# EAGLE design badi (EAGLE 7.6.0)

## Sheet 1 of 2
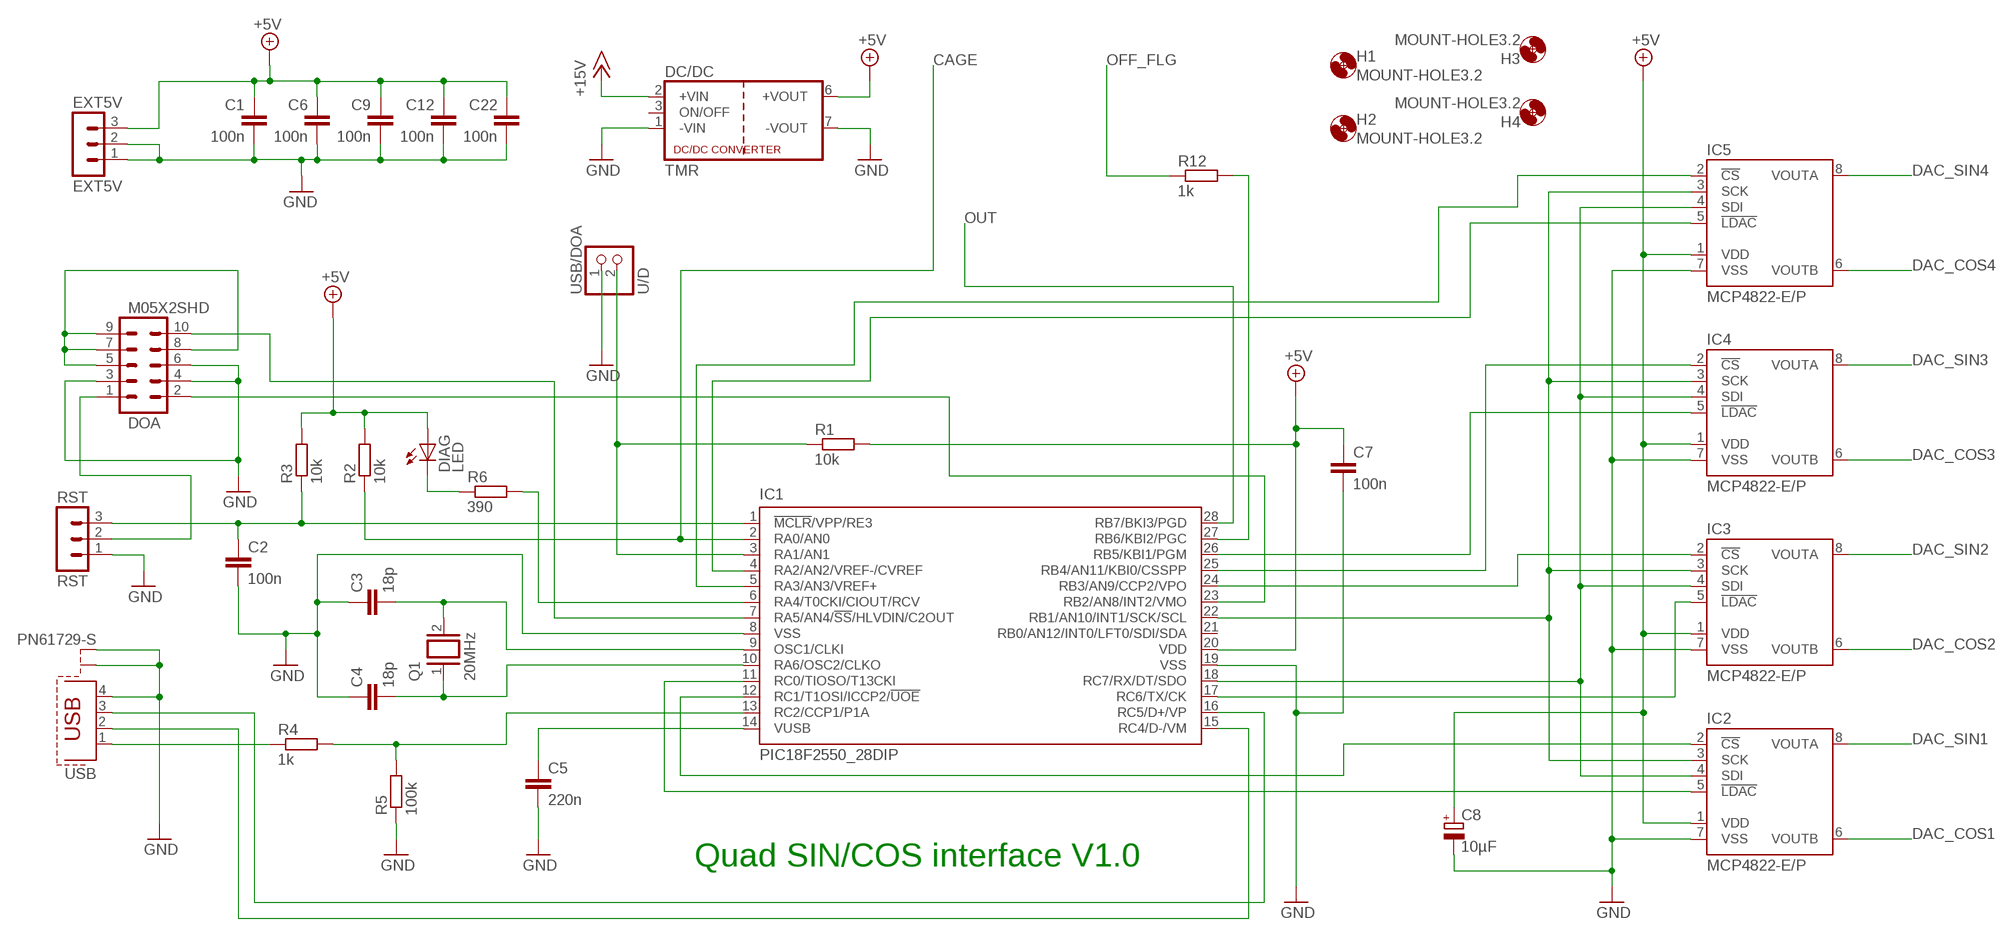
[diagram p0: schematic, sheet 1]

### Parts
C1  100n  C-EU025-025X050  [C025-025X050]
C2  100n  C-EU025-025X050  [C025-025X050]
C3  18p  C-EU025-025X050  [C025-025X050]
C4  18p  C-EU025-025X050  [C025-025X050]
C5  220n  C5/3  [C5B3]
C6  100n  C-EU025-025X050  [C025-025X050]
C7  100n  C-EU025-025X050  [C025-025X050]
C8  10µF  CPOL-EUE2.5-5  [E2,5-5]
C9  100n  C-EU025-025X050  [C025-025X050]
C12  100n  C-EU025-025X050  [C025-025X050]
C22  100n  C-EU025-025X050  [C025-025X050]
DC/DC  TMR  [TRACO_SIP-8]
DIAG  LED  LED3MM  [LED3MM]
DOA  M05X2SHD  [2X5-SHROUDED]
EXT5V  EXT5V  MA03-1  [MA03-1]
H1  MOUNT-HOLE3.2  [3,2]
H2  MOUNT-HOLE3.2  [3,2]
H3  MOUNT-HOLE3.2  [3,2]
H4  MOUNT-HOLE3.2  [3,2]
IC1  PIC18F2550_28DIP  [DIL28-3]
IC2  MCP4822-E/P  [DIL08]
IC3  MCP4822-E/P  [DIL08]
IC4  MCP4822-E/P  [DIL08]
IC5  MCP4822-E/P  [DIL08]
Q1  20MHz  XTAL/S  [QS]
R1  10k  R-EU_0204/7  [0204/7]
R2  10k  R-EU_0204/7  [0204/7]
R3  10k  R-EU_0204/7  [0204/7]
R4  1k  R-EU_0204/7  [0204/7]
R5  100k  R-EU_0204/7  [0204/7]
R6  390  R-EU_0204/7  [0204/7]
R12  1k  R-EU_0204/7  [0204/7]
RST  RST  MA03-1  [MA03-1]
USB  PN61729-S  [PN61729-S]
USB/DOA  U/D  PINHD-1X2  [1X02]

### Nets
+5V [+5V]: C1.1 C6.1 C7.1 C8.+ C9.1 C12.1 C22.1 DC/DC.6(+VOUT) DIAG.A EXT5V.3 IC1.20(VDD) IC2.1(VDD) IC3.1(VDD) IC4.1(VDD) IC5.1(VDD) R1.2 R2.2 R3.2
+15V [V+15]: DC/DC.2(+VIN) ; also sheet 2
CAGE: IC1.2(RA0/AN0) R2.1 ; also sheet 2
DAC_COS1: IC2.6(VOUTB) ; also sheet 2
DAC_COS2: IC3.6(VOUTB) ; also sheet 2
DAC_COS3: IC4.6(VOUTB) ; also sheet 2
DAC_COS4: IC5.6(VOUTB) ; also sheet 2
DAC_SIN1: IC2.8(VOUTA) ; also sheet 2
DAC_SIN2: IC3.8(VOUTA) ; also sheet 2
DAC_SIN3: IC4.8(VOUTA) ; also sheet 2
DAC_SIN4: IC5.8(VOUTA) ; also sheet 2
GND [ground]: C1.2 C2.2 C3.1 C4.1 C5.2 C6.2 C7.2 C8.- C9.2 C12.2 C22.2 DC/DC.1(-VIN) DC/DC.7(-VOUT) DOA.3 DOA.4 DOA.6 EXT5V.1 EXT5V.2 IC1.8(VSS) IC1.19(VSS) IC2.7(VSS) IC3.7(VSS) IC4.7(VSS) IC5.7(VSS) R5.1 RST.1 USB.4 USB.S1 USB.S2 USB/DOA.1 ; also sheet 2
N$7: IC1.12(RC1/T1OSI/ICCP2/!UOE) IC2.2(!CS)
N$8: IC1.11(RC0/TIOSO/T13CKI) IC2.5(!LDAC)
N$14: IC1.24(RB3/AN9/CCP2/VPO) IC3.2(!CS)
N$15: IC1.25(RB4/AN11/KBI0/CSSPP) IC4.2(!CS)
N$20: IC1.4(RA2/AN2/VREF-/CVREF) IC5.5(!LDAC)
N$21: IC1.5(RA3/AN3/VREF+) IC5.2(!CS)
N$24: IC1.17(RC6/TX/CK) IC3.5(!LDAC)
N$25: IC1.18(RC7/RX/DT/SDO) IC2.4(SDI) IC3.4(SDI) IC4.4(SDI) IC5.4(SDI)
N$34: IC1.26(RB5/KBI1/PGM) IC4.5(!LDAC)
N$38: IC1.27(RB6/KBI2/PGC) R12.2
N$43: IC1.22(RB1/AN10/INT1/SCK/SCL) IC2.3(SCK) IC3.3(SCK) IC4.3(SCK) IC5.3(SCK)
N$51: C5.1 IC1.14(VUSB)
N$54: IC1.16(RC5/D+/VP) USB.3
N$61: IC1.15(RC4/D-/VM) USB.2
N$62: R4.1 USB.1
N$63: IC1.13(RC2/CCP1/P1A) R4.2 R5.2
N$64: DOA.1 RST.2
N$65: C4.2 IC1.10(RA6/OSC2/CLKO) Q1.1
N$66: C3.2 IC1.9(OSC1/CLKI) Q1.2
N$67: C2.1 IC1.1(!MCLR!/VPP/RE3) R3.1 RST.3
N$71 [+5V]: DOA.5 DOA.7 DOA.8 DOA.9
N$72: DOA.2 IC1.23(RB2/AN8/INT2/VMO)
N$73: DIAG.K(C) R6.1
N$74: IC1.6(RA4/T0CKI/CIOUT/RCV) R6.2
N$75: DOA.10 IC1.7(RA5/AN4/!SS!/HLVDIN/C2OUT)
N$76: IC1.3(RA1/AN1) R1.1 USB/DOA.2
OFF_FLG: R12.1 ; also sheet 2
OUT: IC1.28(RB7/BKI3/PGD) ; also sheet 2
Unconnected: DC/DC.3(ON/OFF) IC1.21(RB0/AN12/INT0/LFT0/SDI/SDA)

### Notes on the sheet
- Quad SIN/COS interface V1.0

## Sheet 2 of 2
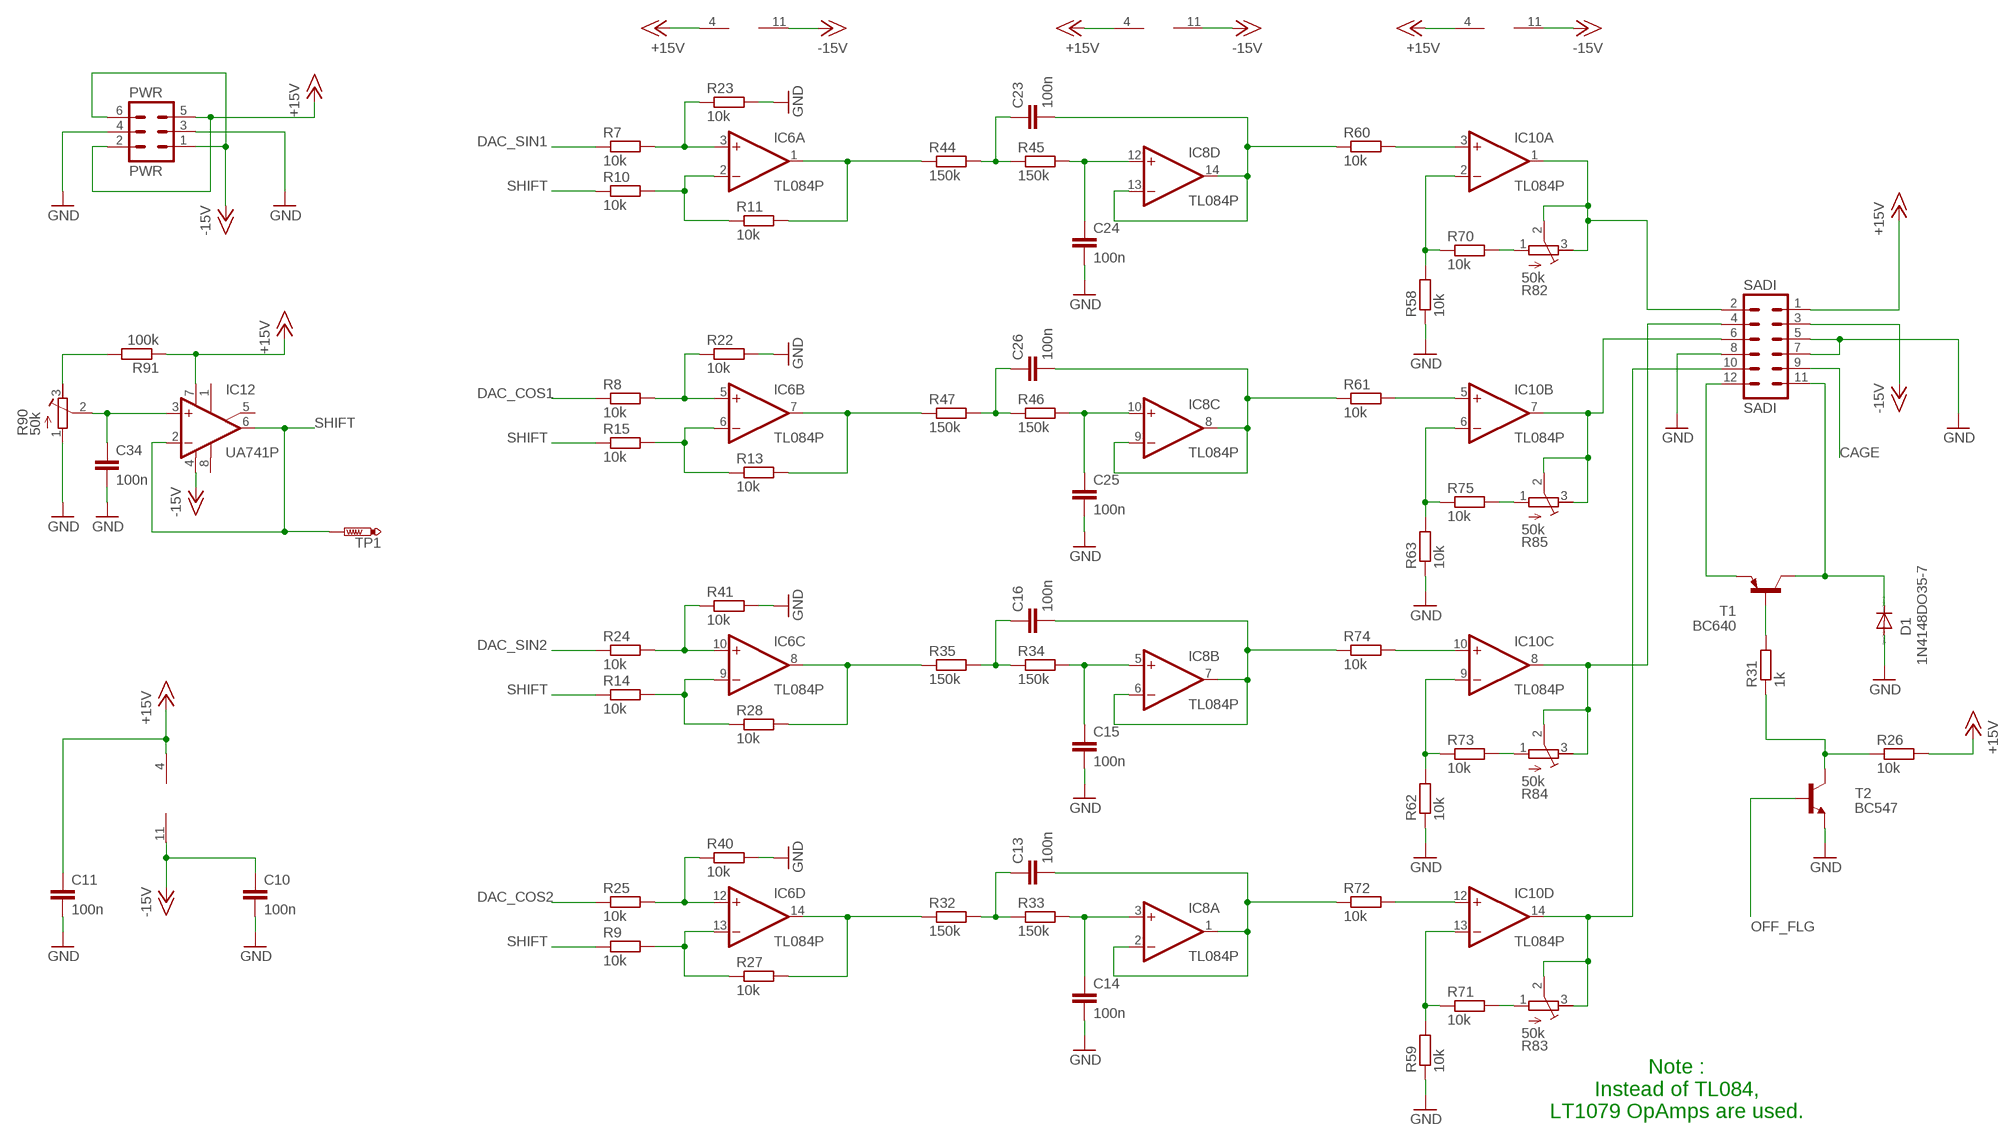
[diagram p1: schematic, sheet 2, part 1 of 2]
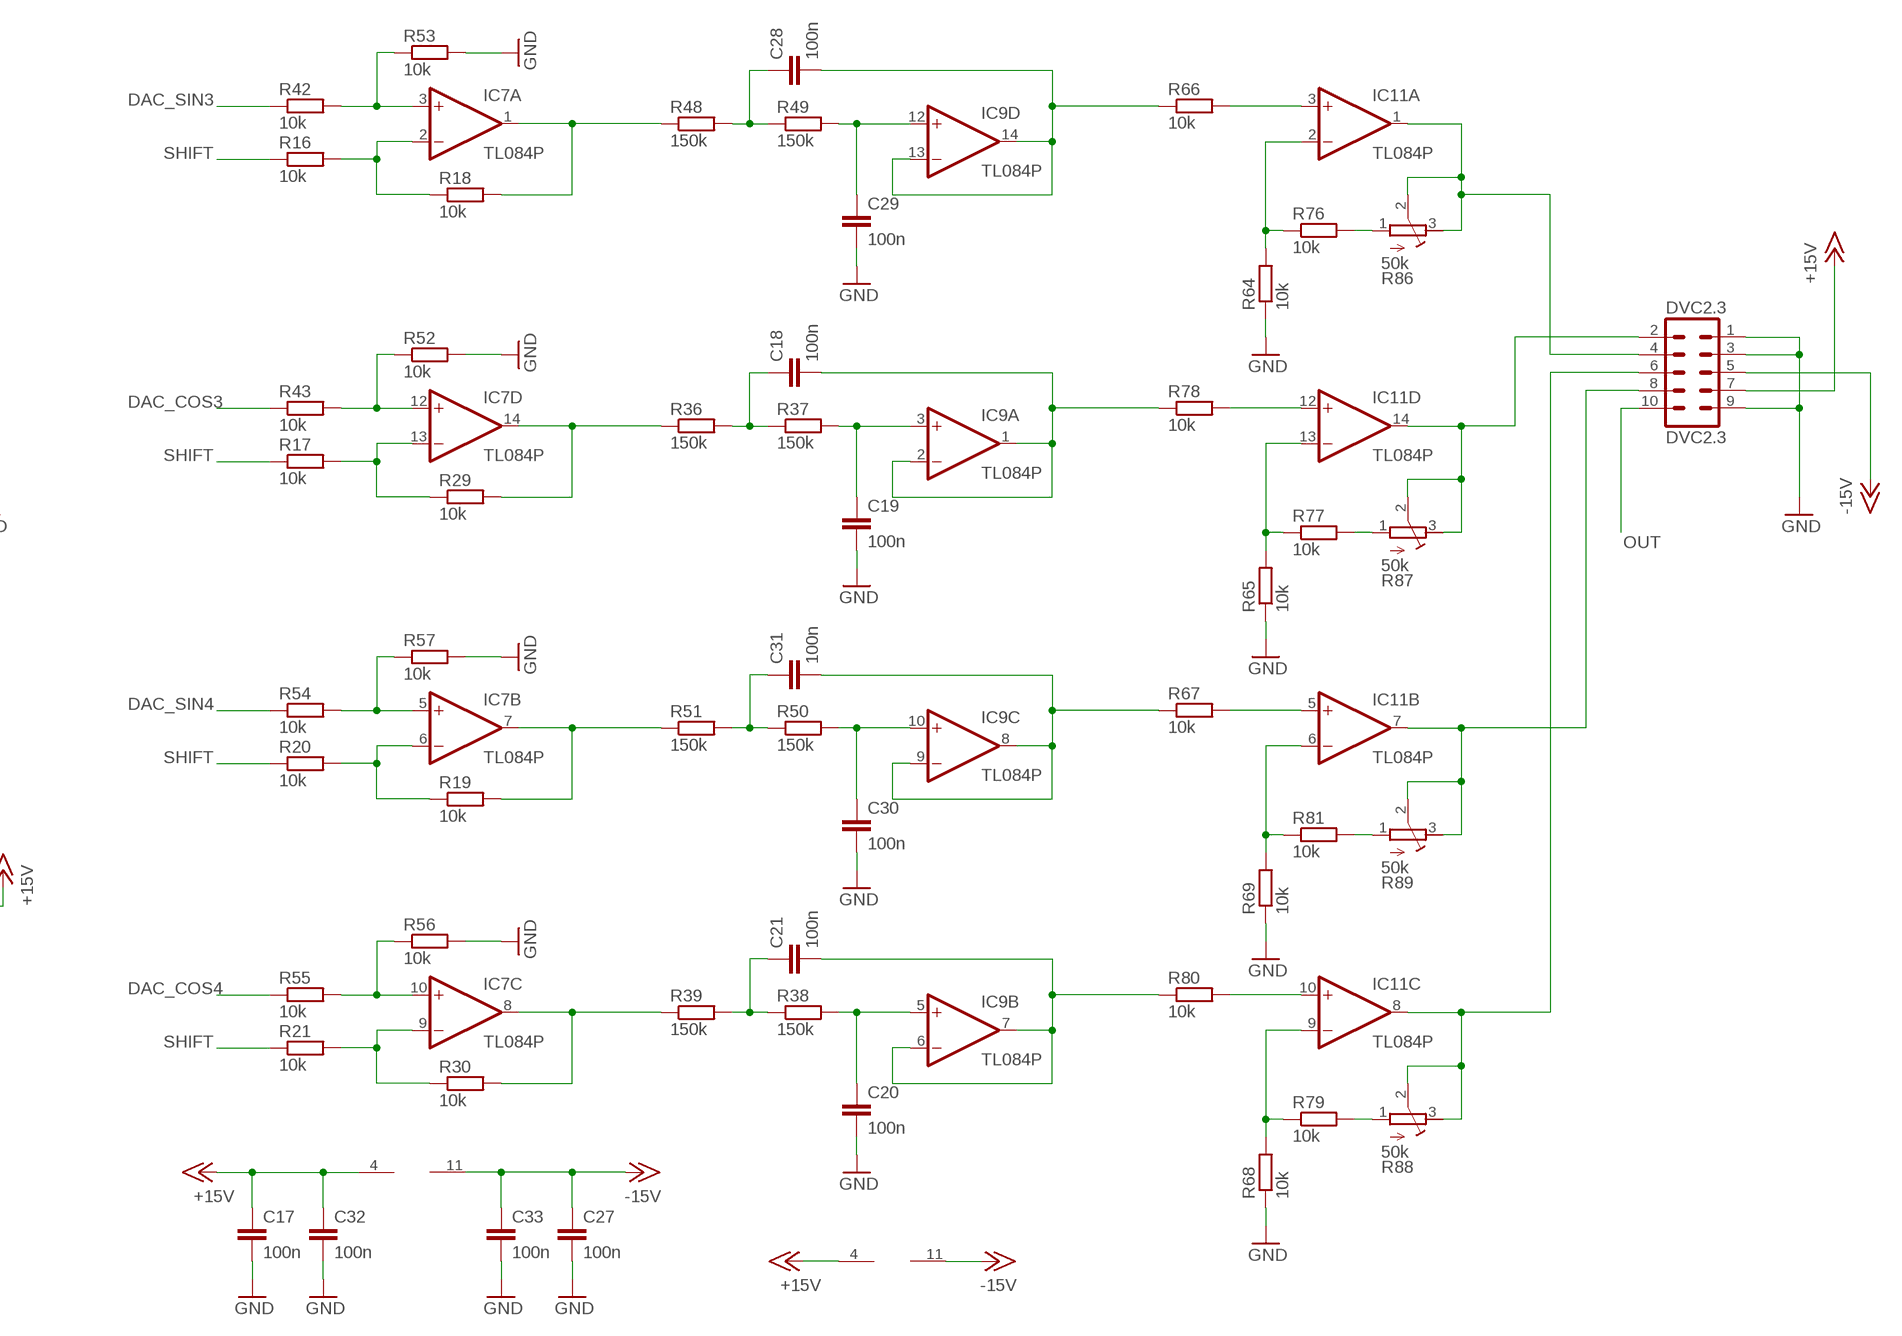
[diagram p2: schematic, sheet 2, part 2 of 2]

### Parts
C10  100n  C-EU025-025X050  [C025-025X050]
C11  100n  C-EU025-025X050  [C025-025X050]
C13  100n  C-EU025-025X050  [C025-025X050]
C14  100n  C-EU025-025X050  [C025-025X050]
C15  100n  C-EU025-025X050  [C025-025X050]
C16  100n  C-EU025-025X050  [C025-025X050]
C17  100n  C-EU025-025X050  [C025-025X050]
C18  100n  C-EU025-025X050  [C025-025X050]
C19  100n  C-EU025-025X050  [C025-025X050]
C20  100n  C-EU025-025X050  [C025-025X050]
C21  100n  C-EU025-025X050  [C025-025X050]
C23  100n  C-EU025-025X050  [C025-025X050]
C24  100n  C-EU025-025X050  [C025-025X050]
C25  100n  C-EU025-025X050  [C025-025X050]
C26  100n  C-EU025-025X050  [C025-025X050]
C27  100n  C-EU025-025X050  [C025-025X050]
C28  100n  C-EU025-025X050  [C025-025X050]
C29  100n  C-EU025-025X050  [C025-025X050]
C30  100n  C-EU025-025X050  [C025-025X050]
C31  100n  C-EU025-025X050  [C025-025X050]
C32  100n  C-EU025-025X050  [C025-025X050]
C33  100n  C-EU025-025X050  [C025-025X050]
C34  100n  C-EU025-025X050  [C025-025X050]
D1  1N4148DO35-7  [DO35-7]
DVC2.3  DVC2.3  MA05-2  [MA05-2]
IC6  TL084P  [DIL14]
IC7  TL084P  [DIL14]
IC8  TL084P  [DIL14]
IC9  TL084P  [DIL14]
IC10  TL084P  [DIL14]
IC11  TL084P  [DIL14]
IC12  UA741P  [DIL08]
PWR  PWR  MA03-2  [MA03-2]
R7  10k  R-EU_0204/7  [0204/7]
R8  10k  R-EU_0204/7  [0204/7]
R9  10k  R-EU_0204/7  [0204/7]
R10  10k  R-EU_0204/7  [0204/7]
R11  10k  R-EU_0204/7  [0204/7]
R13  10k  R-EU_0204/7  [0204/7]
R14  10k  R-EU_0204/7  [0204/7]
R15  10k  R-EU_0204/7  [0204/7]
R16  10k  R-EU_0204/7  [0204/7]
R17  10k  R-EU_0204/7  [0204/7]
R18  10k  R-EU_0204/7  [0204/7]
R19  10k  R-EU_0204/7  [0204/7]
R20  10k  R-EU_0204/7  [0204/7]
R21  10k  R-EU_0204/7  [0204/7]
R22  10k  R-EU_0204/7  [0204/7]
R23  10k  R-EU_0204/7  [0204/7]
R24  10k  R-EU_0204/7  [0204/7]
R25  10k  R-EU_0204/7  [0204/7]
R26  10k  R-EU_0204/7  [0204/7]
R27  10k  R-EU_0204/7  [0204/7]
R28  10k  R-EU_0204/7  [0204/7]
R29  10k  R-EU_0204/7  [0204/7]
R30  10k  R-EU_0204/7  [0204/7]
R31  1k  R-EU_0204/7  [0204/7]
R32  150k  R-EU_0204/7  [0204/7]
R33  150k  R-EU_0204/7  [0204/7]
R34  150k  R-EU_0204/7  [0204/7]
R35  150k  R-EU_0204/7  [0204/7]
R36  150k  R-EU_0204/7  [0204/7]
R37  150k  R-EU_0204/7  [0204/7]
R38  150k  R-EU_0204/7  [0204/7]
R39  150k  R-EU_0204/7  [0204/7]
R40  10k  R-EU_0204/7  [0204/7]
R41  10k  R-EU_0204/7  [0204/7]
R42  10k  R-EU_0204/7  [0204/7]
R43  10k  R-EU_0204/7  [0204/7]
R44  150k  R-EU_0204/7  [0204/7]
R45  150k  R-EU_0204/7  [0204/7]
R46  150k  R-EU_0204/7  [0204/7]
R47  150k  R-EU_0204/7  [0204/7]
R48  150k  R-EU_0204/7  [0204/7]
R49  150k  R-EU_0204/7  [0204/7]
R50  150k  R-EU_0204/7  [0204/7]
R51  150k  R-EU_0204/7  [0204/7]
R52  10k  R-EU_0204/7  [0204/7]
R53  10k  R-EU_0204/7  [0204/7]
R54  10k  R-EU_0204/7  [0204/7]
R55  10k  R-EU_0204/7  [0204/7]
R56  10k  R-EU_0204/7  [0204/7]
R57  10k  R-EU_0204/7  [0204/7]
R58  10k  R-EU_0204/7  [0204/7]
R59  10k  R-EU_0204/7  [0204/7]
R60  10k  R-EU_0204/7  [0204/7]
R61  10k  R-EU_0204/7  [0204/7]
R62  10k  R-EU_0204/7  [0204/7]
R63  10k  R-EU_0204/7  [0204/7]
R64  10k  R-EU_0204/7  [0204/7]
R65  10k  R-EU_0204/7  [0204/7]
R66  10k  R-EU_0204/7  [0204/7]
R67  10k  R-EU_0204/7  [0204/7]
R68  10k  R-EU_0204/7  [0204/7]
R69  10k  R-EU_0204/7  [0204/7]
R70  10k  R-EU_0204/7  [0204/7]
R71  10k  R-EU_0204/7  [0204/7]
R72  10k  R-EU_0204/7  [0204/7]
R73  10k  R-EU_0204/7  [0204/7]
R74  10k  R-EU_0204/7  [0204/7]
R75  10k  R-EU_0204/7  [0204/7]
R76  10k  R-EU_0204/7  [0204/7]
R77  10k  R-EU_0204/7  [0204/7]
R78  10k  R-EU_0204/7  [0204/7]
R79  10k  R-EU_0204/7  [0204/7]
R80  10k  R-EU_0204/7  [0204/7]
R81  10k  R-EU_0204/7  [0204/7]
R82  50k  R-TRIMM64Z  [RTRIM64Z]
R83  50k  R-TRIMM64Z  [RTRIM64Z]
R84  50k  R-TRIMM64Z  [RTRIM64Z]
R85  50k  R-TRIMM64Z  [RTRIM64Z]
R86  50k  R-TRIMM64Z  [RTRIM64Z]
R87  50k  R-TRIMM64Z  [RTRIM64Z]
R88  50k  R-TRIMM64Z  [RTRIM64Z]
R89  50k  R-TRIMM64Z  [RTRIM64Z]
R90  50k  R-TRIMM64Z  [RTRIM64Z]
R91  100k  R-EU_0204/7  [0204/7]
SADI  SADI  MA06-2  [MA06-2]
T1  BC640  [TO92-BCE]
T2  BC547  BC547-NPN-TO92-CBE  [TO92-CBE]
TP1  PTR1B1,27  [B1,27]

### Nets
+15V [V+15]: C11.1 C17.1 C32.1 DVC2.3.7 IC6.4(P:V+) IC7.4(P:V+) IC8.4(P:V+) IC9.4(P:V+) IC10.4(P:V+) IC11.4(P:V+) IC12.7(V+) PWR.2 PWR.5 R26.2 R91.1 SADI.1 ; also sheet 1
-15V [V-15]: C10.1 C27.1 C33.1 DVC2.3.5 IC6.11(P:V-) IC7.11(P:V-) IC8.11(P:V-) IC9.11(P:V-) IC10.11(P:V-) IC11.11(P:V-) IC12.4(V-) PWR.1 PWR.6 SADI.3
CAGE: SADI.9 ; also sheet 1
DAC_COS1: R8.1 ; also sheet 1
DAC_COS2: R25.1 ; also sheet 1
DAC_COS3: R43.1 ; also sheet 1
DAC_COS4: R55.1 ; also sheet 1
DAC_SIN1: R7.1 ; also sheet 1
DAC_SIN2: R24.1 ; also sheet 1
DAC_SIN3: R42.1 ; also sheet 1
DAC_SIN4: R54.1 ; also sheet 1
GND [ground]: C10.2 C11.2 C14.2 C15.2 C17.2 C19.2 C20.2 C24.2 C25.2 C27.2 C29.2 C30.2 C32.2 C33.2 C34.2 D1.A DVC2.3.1 DVC2.3.3 DVC2.3.9 PWR.3 PWR.4 R22.2 R23.2 R40.2 R41.2 R52.2 R53.2 R56.2 R57.2 R58.1 R59.1 R62.1 R63.1 R64.1 R65.1 R68.1 R69.1 R90.1(A) SADI.5 SADI.7 SADI.8 T2.E ; also sheet 1
N$1: IC6.3(A:+IN) R7.2 R23.1
N$2: IC6.1(A:OUT) R11.2 R44.1
N$3: IC6.5(B:+IN) R8.2 R22.1
N$4: C13.1 R32.2 R33.1
N$5: C14.1 IC8.3(A:+IN) R33.2
N$6: C13.2 IC8.1(A:OUT) IC8.2(A:-IN) R72.1
N$9: C23.1 R44.2 R45.1
N$10: C23.2 IC8.13(D:-IN) IC8.14(D:OUT) R60.1
N$11: IC6.6(B:-IN) R13.1 R15.2
N$12: IC6.7(B:OUT) R13.2 R47.1
N$13: IC6.10(C:+IN) R24.2 R41.1
N$16: C24.1 IC8.12(D:+IN) R45.2
N$17: C28.1 R48.2 R49.1
N$18: SADI.12 T1.E
N$19: IC6.9(C:-IN) R14.2 R28.1
N$22: C29.1 IC9.12(D:+IN) R49.2
N$23: IC6.8(C:OUT) R28.2 R35.1
N$26: IC6.12(D:+IN) R25.2 R40.1
N$27: C18.1 R36.2 R37.1
N$28: C19.1 IC9.3(A:+IN) R37.2
N$29: C18.2 IC9.1(A:OUT) IC9.2(A:-IN) R78.1
N$30: IC6.13(D:-IN) R9.2 R27.1
N$31: IC6.14(D:OUT) R27.2 R32.1
N$32: IC7.12(D:+IN) R43.2 R52.1
N$33: C28.2 IC9.13(D:-IN) IC9.14(D:OUT) R66.1
N$35: C34.1 IC12.3(+IN) R90.2(S)
N$36: R90.3(E) R91.2
N$37: D1.C SADI.11 T1.C
N$39: IC6.2(A:-IN) R10.2 R11.1
N$40: IC7.6(B:-IN) R19.1 R20.2
N$41: IC7.3(A:+IN) R42.2 R53.1
N$42: IC7.2(A:-IN) R16.2 R18.1
N$44: IC7.1(A:OUT) R18.2 R48.1
N$45: IC7.13(D:-IN) R17.2 R29.1
N$46: IC7.14(D:OUT) R29.2 R36.1
N$47: IC7.5(B:+IN) R54.2 R57.1
N$48: IC7.7(B:OUT) R19.2 R51.1
N$49: IC7.10(C:+IN) R55.2 R56.1
N$50: IC7.9(C:-IN) R21.2 R30.1
N$52: IC7.8(C:OUT) R30.2 R39.1
N$53: C15.1 IC8.5(B:+IN) R34.2
N$55: C16.1 R34.1 R35.2
N$56: C16.2 IC8.6(B:-IN) IC8.7(B:OUT) R74.1
N$57: C25.1 IC8.10(C:+IN) R46.2
N$58: C26.2 IC8.8(C:OUT) IC8.9(C:-IN) R61.1
N$59: C26.1 R46.1 R47.2
N$60: C30.1 IC9.10(C:+IN) R50.2
N$68: C31.1 R50.1 R51.2
N$69: C31.2 IC9.8(C:OUT) IC9.9(C:-IN) R67.1
N$70: C20.1 IC9.5(B:+IN) R38.2
N$77: C21.2 IC9.6(B:-IN) IC9.7(B:OUT) R80.1
N$78: C21.1 R38.1 R39.2
N$79: IC10.1(A:OUT) R82.2(S) R82.3(E) SADI.2
N$80: DVC2.3.6 IC11.8(C:OUT) R88.2(S) R88.3(E)
N$81: IC10.7(B:OUT) R85.2(S) R85.3(E) SADI.6
N$82: R26.1 R31.1 T2.C
N$83: IC10.8(C:OUT) R84.2(S) R84.3(E) SADI.4
N$84: IC11.2(A:-IN) R64.2 R76.1
N$85: IC10.14(D:OUT) R83.2(S) R83.3(E) SADI.10
N$86: IC11.13(D:-IN) R65.2 R77.1
N$87: IC10.3(A:+IN) R60.2
N$88: IC10.5(B:+IN) R61.2
N$89: IC10.10(C:+IN) R74.2
N$90: IC10.12(D:+IN) R72.2
N$91: IC10.13(D:-IN) R59.2 R71.1
N$92: IC10.2(A:-IN) R58.2 R70.1
N$93: IC10.6(B:-IN) R63.2 R75.1
N$94: IC10.9(C:-IN) R62.2 R73.1
N$95: R71.2 R83.1(A)
N$96: R70.2 R82.1(A)
N$97: R75.2 R85.1(A)
N$98: R73.2 R84.1(A)
N$99: DVC2.3.4 IC11.1(A:OUT) R86.2(S) R86.3(E)
N$100: IC11.6(B:-IN) R69.2 R81.1
N$101: DVC2.3.2 IC11.14(D:OUT) R87.2(S) R87.3(E)
N$102: IC11.9(C:-IN) R68.2 R79.1
N$103: DVC2.3.8 IC11.7(B:OUT) R89.2(S) R89.3(E)
N$104: R81.2 R89.1(A)
N$105: R76.2 R86.1(A)
N$106: IC11.12(D:+IN) R78.2
N$107: IC11.3(A:+IN) R66.2
N$108: R77.2 R87.1(A)
N$109: R79.2 R88.1(A)
N$110: IC11.10(C:+IN) R80.2
N$111: IC11.5(B:+IN) R67.2
N$112: R31.2 T1.B
OFF_FLG: T2.B ; also sheet 1
OUT: DVC2.3.10 ; also sheet 1
SHIFT: IC12.2(-IN) IC12.6(OUT) R9.1 R10.1 R14.1 R15.1 R16.1 R17.1 R20.1 R21.1 TP1.TP
Unconnected: IC12.1(ON1) IC12.5(ON2) IC12.8(OPT)

### Notes on the sheet
- Note :
  Instead of TL084,
  LT1079 OpAmps are used.

## Library data of the parts
C1-C4 C6 C7 C9-C34 = rcl:C-EU: CAPACITOR, European symbol
C5 = capacitor-wima:C: CAPACITOR naming: grid - package width
C8 = rcl:CPOL-EU: POLARIZED CAPACITOR, European symbol
D1 = diode:1N4148: DIODE high speed (Philips)
DC/DC = traco-tmr:TMR
DIAG = henk:LED: LEDs Standard schematic elements and footprints for 5mm, 3mm, 1206, and 0603 sized LEDs. 5mm - Spark Fun Electronics SKU : COM-00529 (and others)
DOA = henk:M05X2: Header 5x2 Standard 10-pin dual row 0.1" header. Commonly used with AVR-ISP. Use with Spark Fun Electronics SKU: PRT-00778
DVC2.3 = con-lstb:MA05-2: PIN HEADER; OC_FARNELL: unknown; OC_NEWARK: unknown
EXT5V RST = con-lstb:MA03-1: PIN HEADER; OC_FARNELL: unknown; OC_NEWARK: unknown
H1-H4 = holes:MOUNT-HOLE: MOUNTING HOLE with drill center marker
IC1 = microchip:PIC18F2*_28: USB Microcontrollers with nanoWatt Technology High-Performance, Enhanced Flash, 28/40/44-Pin, Source: http://ww1.microchip.com/downloads/en/devicedoc/39632c.pdf; MF: MICROCHIP; MPN: PIC18F2550-I/SP; OC_FARNELL: 1523822; OC_NEWARK: 80K6054
IC2-IC5 = nh-ic:MCP4822: Microchip MCP4822 According to datasheet http://ww1.microchip.com/downloads/en/DeviceDoc/22249A.pdf. Created by Nils Hintze <n.hintze@elektronikpage.net>
IC6-IC11 = linear:TL084: OP AMP
IC12 = linear:*741: OP AMP
PWR = con-lstb:MA03-2: PIN HEADER; OC_FARNELL: unknown; OC_NEWARK: unknown
Q1 = special:XTAL/S: CRYSTAL
R1-R81 R91 = rcl:R-EU_: RESISTOR, European symbol
R82-R90 = rcl:R-TRIMM: Trimm resistor
SADI = con-lstb:MA06-2: PIN HEADER; OC_FARNELL: unknown; OC_NEWARK: unknown
T1 = transistor-pnp:BC640*: PNP Transistror
T2 = transistor:*-NPN-: NPN Transistror BF959 corrected 2008.03.06
TP1 = testpad:PTR1: TEST PIN
USB = con-berg:PN61729-S: BERG USB connector; OC_FARNELL: unknown; OC_NEWARK: unknown
USB/DOA = pinhead:PINHD-1X2: PIN HEADER

## Net classes
0 default: width 0.254 mm, clearance 0.305 mm
1 ground: width 0.508 mm, clearance 0.305 mm
2 +5V: width 0.508 mm, clearance 0.305 mm
3 -5V: width 0.406 mm, clearance 0.305 mm
4 V-15: width 0.406 mm, clearance 0.305 mm
5 V+15: width 0.406 mm, clearance 0.305 mm
6 V+24: width 0.406 mm, clearance 0.305 mm

## Board
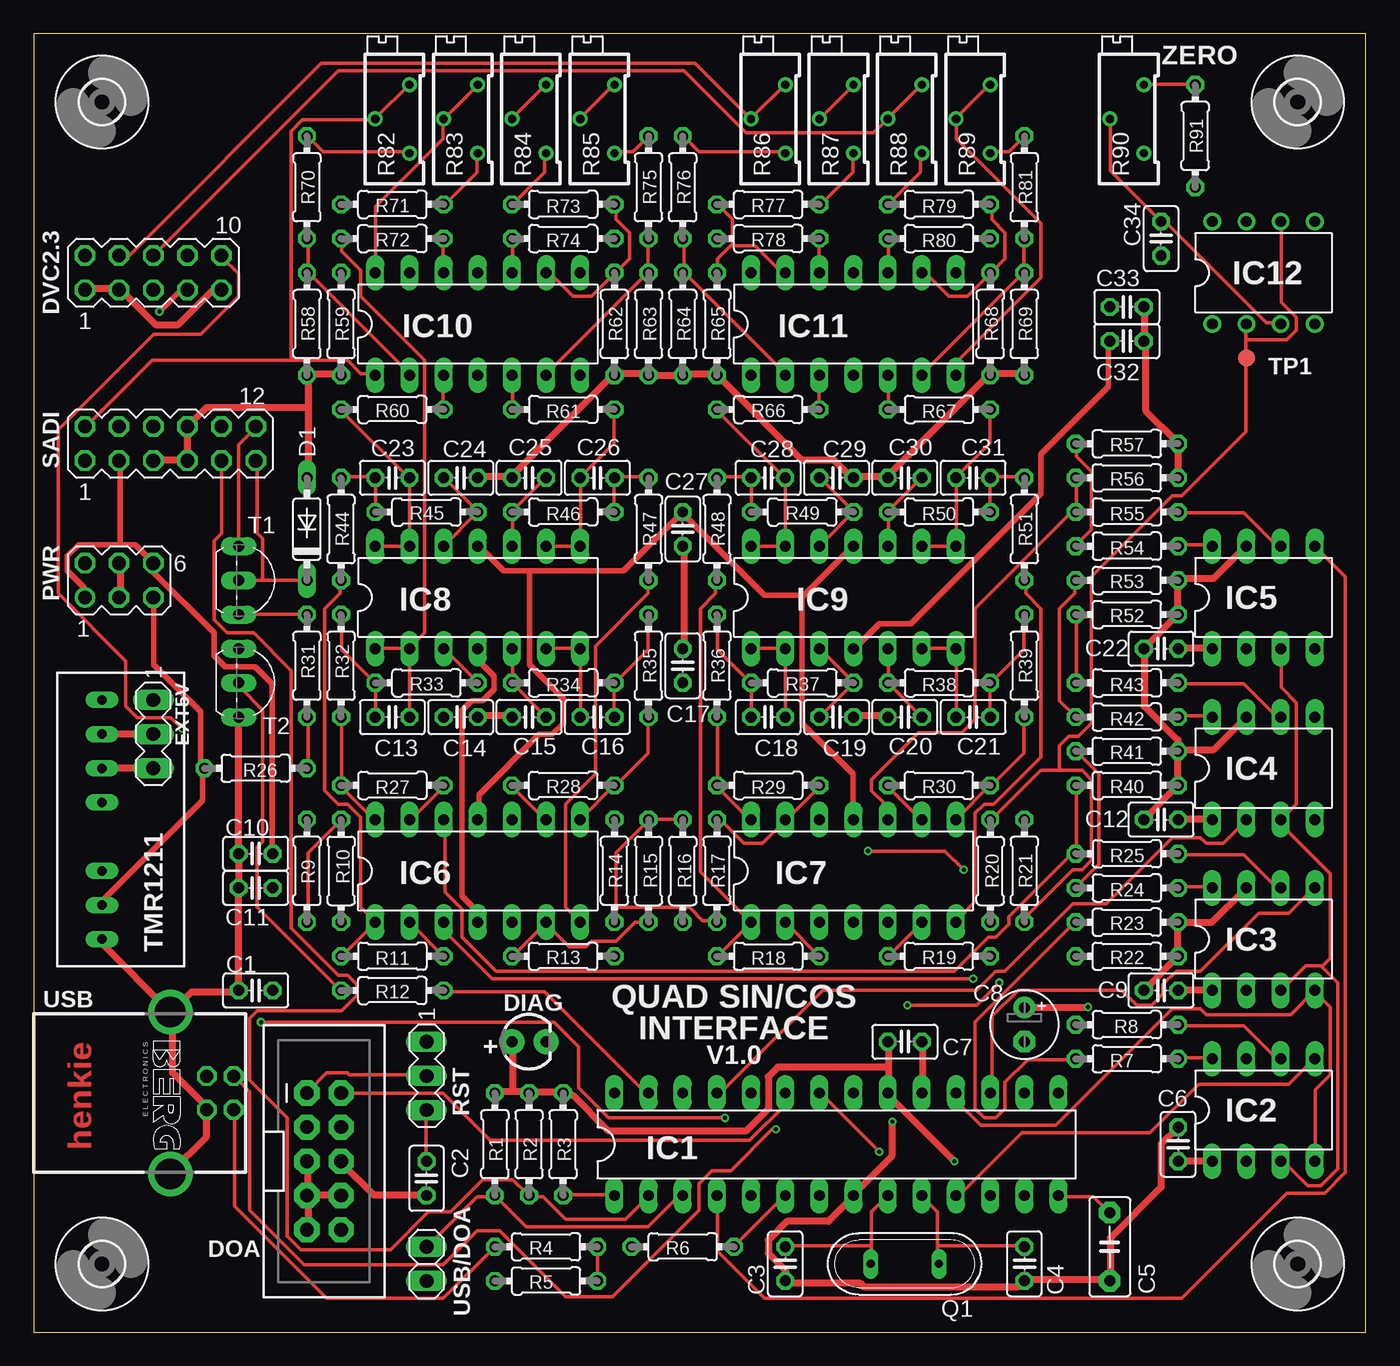
[diagram p3: board, top side]
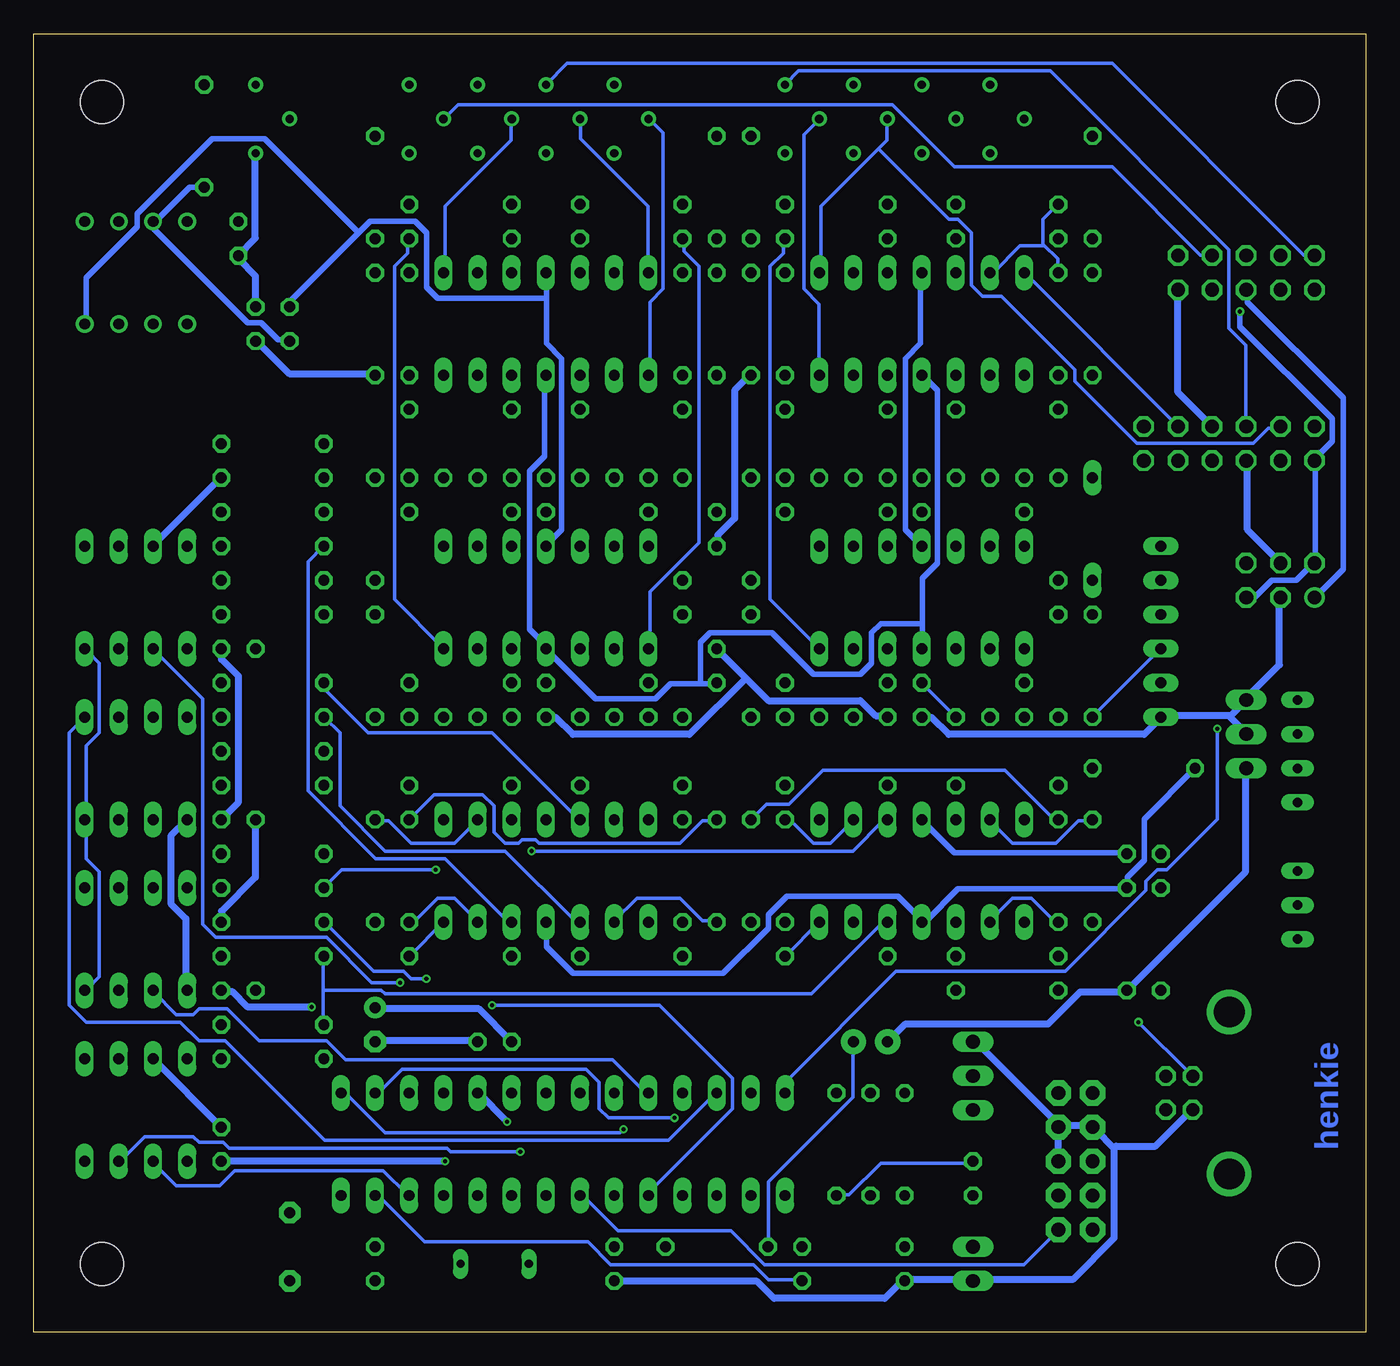
[diagram p4: board, bottom side, seen from below]

Size 99.05 x 96.51 mm. Coordinates in mm from the lower left corner, seen from the top.
Outline: 0,0 99.05,0 99.05,96.51 0,96.51 0,0
Copper layers (1*16): Top 0.035mm / dielectric 1.5mm / Bottom 0.035mm
Design rules "ITEADstudio_DRC": minimum track width 6mil, minimum drill 12mil, track to track 6mil, track to pad 6mil, pad to pad 6mil, via to via 6mil, smd to smd 0mil, copper to edge 10mil, drill to drill 10mil, minimum pad ring 10mil, minimum via ring 6mil, stop-mask expansion 2mil, vias tented up to drill 100mil, thermal gap 10mil

### Footprints (pad centres in the part's own frame; a part is rotated, then mirrored left to right if it is on the bottom)
C025-025X050 = drill 0.813 octagon: 1 -1.27,0; 2 1.27,0
C5B3 = drill 0.813 pad 1.6 octagon: 1 -2.54,0; 2 2.54,0
E2,5-5 = drill 0.813 pad 1.6: + -1.27,0 | drill 0.813 pad 1.6 octagon: - 1.27,0
DO35-7 = drill 0.813 long: A 3.81,0; C -3.81,0
TRACO_SIP-8 = drill 0.7 long: 1 -8.89,0; 2 -6.35,0; 3 -3.81,0; 5 1.27,0; 6 3.81,0; 7 6.35,0; 8 8.89,0
LED3MM = drill 0.813 pad 1.88: A -1.27,0; K 1.27,0
2X5-SHROUDED = drill 1.016 pad 1.88 octagon: 1 -1.27,5.08; 2 1.27,5.08; 3 -1.27,2.54; 4 1.27,2.54; 5 -1.27,0; 6 1.27,0; 7 -1.27,-2.54; 8 1.27,-2.54; 9 -1.27,-5.08; 10 1.27,-5.08
MA05-2 = drill 1.016 octagon: 1 -5.08,-1.27; 2 -5.08,1.27; 3 -2.54,-1.27; 4 -2.54,1.27; 5 0,-1.27; 6 0,1.27; 7 2.54,-1.27; 8 2.54,1.27; 9 5.08,-1.27; 10 5.08,1.27
MA03-1 = drill 1.016 long: 1 -2.54,0; 2 0,0; 3 2.54,0
3,2 = hole 3.2: 0,0
DIL28-3 = drill 0.813 long: 1 -16.51,-3.81; 2 -13.97,-3.81; 3 -11.43,-3.81; 4 -8.89,-3.81; 5 -6.35,-3.81; 6 -3.81,-3.81; 7 -1.27,-3.81; 8 1.27,-3.81; 9 3.81,-3.81; 10 6.35,-3.81; 11 8.89,-3.81; 12 11.43,-3.81; 13 13.97,-3.81; 14 16.51,-3.81; 15 16.51,3.81; 16 13.97,3.81; 17 11.43,3.81; 18 8.89,3.81; 19 6.35,3.81; 20 3.81,3.81; 21 1.27,3.81; 22 -1.27,3.81; 23 -3.81,3.81; 24 -6.35,3.81; 25 -8.89,3.81; 26 -11.43,3.81; 27 -13.97,3.81; 28 -16.51,3.81
DIL08 = drill 0.813 long: 1 -3.81,-3.81; 2 -1.27,-3.81; 3 1.27,-3.81; 4 3.81,-3.81; 5 3.81,3.81; 6 1.27,3.81; 7 -1.27,3.81; 8 -3.81,3.81
DIL14 = drill 0.813 long: 1 -7.62,-3.81; 2 -5.08,-3.81; 3 -2.54,-3.81; 4 0,-3.81; 5 2.54,-3.81; 6 5.08,-3.81; 7 7.62,-3.81; 8 7.62,3.81; 9 5.08,3.81; 10 2.54,3.81; 11 0,3.81; 12 -2.54,3.81; 13 -5.08,3.81; 14 -7.62,3.81
DIL08' = drill 0.813 pad 1.27: 1 -3.81,-3.81; 2 -1.27,-3.81; 3 1.27,-3.81; 4 3.81,-3.81; 5 3.81,3.81; 6 1.27,3.81; 7 -1.27,3.81; 8 -3.81,3.81
MA03-2 = drill 1.016: 1 -2.54,-1.27 | drill 1.016 octagon: 2 -2.54,1.27; 3 0,-1.27; 4 0,1.27; 5 2.54,-1.27; 6 2.54,1.27
QS = drill 0.61 long: 1 -2.54,0; 2 2.54,0
0204/7 = drill 0.813 octagon: 1 -3.81,0; 2 3.81,0
RTRIM64Z = drill 0.61: 1 0,-2.54; 2 -2.54,0; 3 0,2.54
MA06-2 = drill 1.016 octagon: 1 -6.35,-1.27; 2 -6.35,1.27; 3 -3.81,-1.27; 4 -3.81,1.27; 5 -1.27,-1.27; 6 -1.27,1.27; 7 1.27,-1.27; 8 1.27,1.27; 9 3.81,-1.27; 10 3.81,1.27; 11 6.35,-1.27; 12 6.35,1.27
TO92-BCE = drill 0.813 long: B 2.54,0; C 0,0; E -2.54,0
TO92-CBE = drill 0.813 long: B 0,0; C -2.54,0; E 2.54,0
B1,27 = smd 1.27 x 1.27: TP 0,0
PN61729-S = drill 0.95 octagon: 1 1.25,4.71; 2 -1.25,4.71; 3 -1.25,2.71; 4 1.25,2.71 | drill 2.3 pad 2.9: S1 -6.02,0; S2 6.02,0
1X02 = drill 1.016 long: 1 -1.27,0; 2 1.27,0

### Placement (x,y rotation side)
C1  16.51,25.4 180 top
C2  29.21,11.43 270 top
C3  55.88,5.08 90 top
C4  73.66,5.08 90 top
C5  80.01,6.35 270 top
C6  85.09,13.97 90 top
C7  64.77,21.59 0 top
C8  73.66,22.86 270 top
C9  83.82,25.4 180 top
C10  16.51,35.56 180 top
C11  16.51,33.02 180 top
C12  83.82,38.1 180 top
C13  26.67,45.72 0 top
C14  31.75,45.72 0 top
C15  36.83,45.72 180 top
C16  41.91,45.72 180 top
C17  48.26,49.53 90 top
C18  54.61,45.72 0 top
C19  59.69,45.72 0 top
C20  64.77,45.72 180 top
C21  69.85,45.72 180 top
C22  83.82,50.8 180 top
C23  26.67,63.5 0 top
C24  31.75,63.5 0 top
C25  36.83,63.5 180 top
C26  41.91,63.5 180 top
C27  48.26,59.69 270 top
C28  54.61,63.5 0 top
C29  59.69,63.5 0 top
C30  64.77,63.5 180 top
C31  69.85,63.5 180 top
C32  81.28,73.66 0 top
C33  81.28,76.2 0 top
C34  83.82,81.28 270 top
D1  20.32,59.69 90 top
DC/DC  5.08,38.1 90 top
DIAG  36.83,21.59 0 top
DOA  21.59,12.7 0 top
DVC2.3  8.89,78.74 0 top
EXT5V  8.89,44.45 270 top
H1  5.08,91.44 0 top
H2  93.98,5.08 0 top
H3  5.08,5.08 0 top
H4  93.98,91.44 0 top
IC1  59.69,13.97 0 top
IC2  91.44,16.51 0 top
IC3  91.44,29.21 0 top
IC4  91.44,41.91 0 top
IC5  91.44,54.61 0 top
IC6  33.02,34.29 0 top
IC7  60.96,34.29 0 top
IC8  33.02,54.61 0 top
IC9  60.96,54.61 0 top
IC10  33.02,74.93 0 top
IC11  60.96,74.93 0 top
IC12  UA741P  [DIL08']  91.44,78.74 0 top
PWR  6.35,55.88 0 top
Q1  64.77,5.08 180 top
R1  34.29,13.97 90 top
R2  36.83,13.97 90 top
R3  39.37,13.97 90 top
R4  38.1,6.35 0 top
R5  38.1,3.81 0 top
R6  48.26,6.35 0 top
R7  81.28,20.32 180 top
R8  81.28,22.86 180 top
R9  20.32,34.29 90 top
R10  22.86,34.29 270 top
R11  26.67,27.94 180 top
R12  26.67,25.4 0 top
R13  39.37,27.94 0 top
R14  43.18,34.29 90 top
R15  45.72,34.29 270 top
R16  48.26,34.29 270 top
R17  50.8,34.29 90 top
R18  54.61,27.94 180 top
R19  67.31,27.94 0 top
R20  71.12,34.29 270 top
R21  73.66,34.29 90 top
R22  81.28,27.94 0 top
R23  81.28,30.48 0 top
R24  81.28,33.02 180 top
R25  81.28,35.56 180 top
R26  16.51,41.91 180 top
R27  26.67,40.64 180 top
R28  39.37,40.64 0 top
R29  54.61,40.64 180 top
R30  67.31,40.64 0 top
R31  20.32,49.53 90 top
R32  22.86,49.53 90 top
R33  29.21,48.26 0 top
R34  39.37,48.26 180 top
R35  45.72,49.53 90 top
R36  50.8,49.53 90 top
R37  57.15,48.26 0 top
R38  67.31,48.26 180 top
R39  73.66,49.53 90 top
R40  81.28,40.64 0 top
R41  81.28,43.18 0 top
R42  81.28,45.72 180 top
R43  81.28,48.26 180 top
R44  22.86,59.69 90 top
R45  29.21,60.96 0 top
R46  39.37,60.96 180 top
R47  45.72,59.69 90 top
R48  50.8,59.69 90 top
R49  57.15,60.96 0 top
R50  67.31,60.96 180 top
R51  73.66,59.69 90 top
R52  81.28,53.34 0 top
R53  81.28,55.88 0 top
R54  81.28,58.42 180 top
R55  81.28,60.96 180 top
R56  81.28,63.5 0 top
R57  81.28,66.04 0 top
R58  20.32,74.93 90 top
R59  22.86,74.93 90 top
R60  26.67,68.58 0 top
R61  39.37,68.58 180 top
R62  43.18,74.93 90 top
R63  45.72,74.93 90 top
R64  48.26,74.93 90 top
R65  50.8,74.93 90 top
R66  54.61,68.58 0 top
R67  67.31,68.58 180 top
R68  71.12,74.93 90 top
R69  73.66,74.93 90 top
R70  20.32,85.09 90 top
R71  26.67,83.82 0 top
R72  26.67,81.28 0 top
R73  39.37,83.82 180 top
R74  39.37,81.28 180 top
R75  45.72,85.09 90 top
R76  48.26,85.09 90 top
R77  54.61,83.82 0 top
R78  54.61,81.28 0 top
R79  67.31,83.82 180 top
R80  67.31,81.28 180 top
R81  73.66,85.09 90 top
R82  27.94,90.17 0 top
R83  33.02,90.17 0 top
R84  38.1,90.17 0 top
R85  43.18,90.17 0 top
R86  55.88,90.17 0 top
R87  60.96,90.17 0 top
R88  66.04,90.17 0 top
R89  71.12,90.17 0 top
R90  82.55,90.17 0 top
R91  86.36,88.9 90 top
RST  29.21,19.05 270 top
SADI  10.16,66.04 0 top
T1  15.24,55.88 270 top
T2  15.24,48.26 270 top
TP1  90.17,72.39 0 top
USB  10.16,17.78 270 top
USB/DOA  29.21,5.08 90 top

### Tracks (layer width: path | path; a pad name or v marks a point on that pad's centre or on a via)
+5V  (via drill 0.3)
  Top 0.508: 35.62,17.88 36.74,17.88 R2.2 37.02,17.88 39.26,17.88 R3.2 39.53,17.6 40.09,17.6 42.75,14.95 52.95,14.95 54.62,16.62 54.62,19 55.32,19.7 63.56,19.7 | 35.62,17.88 34.37,17.88 R1.2 | EXT5V.3 DC/DC.6 | 35.62,17.88 35.62,21.51 DIAG.A | C22.1 85.22,50.85 87.59,50.85 IC5.1 | C9.1 85.22,25.43 87.59,25.43 IC3.1 | C12.1 85.22,38.14 87.59,38.14 IC4.1 | C6.1 85.22,12.71 87.59,12.71 IC2.1 | 63.56,19.7 63.56,21.51 C7.1 | 63.56,19.7 63.56,17.88 IC1.20 63.56,17.6 v68.45,12.71 | v78.37,24.17 73.76,24.17 C8.+
  Bottom 0.508: DIAG.A 35.48,21.65 34.23,22.91 23.61,22.91 21.23,25.29 17.88,25.29 C1.1 17.6,25.57 8.94,34.23 8.94,41.91 EXT5V.3 | IC4.1 88.85,36.88 88.85,31.85 87.73,30.73 87.73,25.43 IC3.1 | C22.1 85.08,50.71 85.08,50.01 83.82,48.76 83.82,39.4 85.08,38.14 C12.1 | C7.1 65.94,24.03 73.62,24.03 C8.+ | v68.45,12.71 85.08,12.71 C6.1 | v78.37,24.17 83.12,24.17 84.24,25.29 85.08,25.29 C9.1
+15V  (via drill 0.3)
  Top 0.406: C32.1 79.91,73.62 79.91,70.27 74.88,65.24 74.88,62.31 65.24,52.67 62.87,52.67 61.05,50.85 IC9.4 | v9.36,75.86 10.9,77.39 11.32,77.39 DVC2.3.7 | DC/DC.2 5.17,31.85 5.17,32.13 12.57,39.53 12.57,41.91 R26.2 12.43,42.05 12.43,46.1 8.94,49.59 8.94,54.48 PWR.5 | IC8.4 33.11,50.71 33.11,49.87 34.23,48.76 34.23,47.78 33.39,46.94 32.55,46.94 31.85,46.24 31.85,32.41 32.97,31.29 32.97,30.59 IC6.4
  Bottom 0.406: C32.1 80.05,73.76 80.89,73.76 82.14,75.02 83.12,75.02 90.11,82 90.11,82.42 IC12.7 89.97,82.56 87.45,85.08 86.47,85.08 R91.1 | 49.45,48.2 51.69,48.2 52.81,47.08 57.28,47.08 60.91,50.71 IC9.4 60.91,50.99 62.17,52.25 62.17,63.98 61.05,65.1 61.05,71.11 IC11.4 | 49.45,48.2 48.34,48.2 C17.1 | PWR.5 8.8,54.62 8.24,54.62 6.99,55.88 5.17,55.88 3.91,57.14 PWR.2 3.77,57.28 3.77,64.68 SADI.1 3.77,64.96 2.52,66.22 2.52,67.89 9.36,74.74 v9.36,75.86 | 32.97,52.67 32.97,56.02 31.85,57.14 31.85,69.99 32.97,71.11 IC10.4 | 32.97,52.67 32.97,50.85 IC8.4 | R26.2 12.71,41.91 16.48,38.14 16.48,35.06 17.74,33.81 17.74,33.11 C11.1 17.88,32.97 30.32,32.97 32.69,30.59 32.97,30.59 IC6.4 33.11,30.73 34.78,32.41 43.03,32.41 44.42,31.01 44.42,30.04 47.78,26.68 58.95,26.68 60.91,28.64 60.91,30.45 IC7.4 | 49.45,48.2 49.45,51.27 48.76,51.97 44.15,51.97 41.07,48.9 37.58,48.9 36.74,49.73 36.74,51.97 36.04,52.67 32.97,52.67
-15V
  Top 0.406: 57.14,54.62 57.14,45.26 60.91,41.49 60.91,38.14 IC7.11 | 57.14,54.62 60.91,58.4 IC9.11 | 6.43,58.53 7.54,58.53 8.8,57.28 PWR.6 8.94,57 8.94,56.44 13.41,51.97 13.41,50.29 14.25,49.45 16.48,49.45 17.74,48.2 17.74,35.62 C10.1 | 6.43,58.53 3.35,58.53 2.52,57.7 2.52,56.58 3.77,55.32 3.77,54.62 PWR.1 | 6.43,58.53 6.43,64.68 SADI.3 | 36.88,56.58 43.87,56.58 48.2,60.91 C27.1 48.34,60.77 54.34,54.76 57,54.76 57.14,54.62 | 36.88,56.58 34.92,56.58 33.11,58.4 IC8.11 | 36.88,56.58 36.88,49.59 39.4,47.08 39.4,45.26 38.56,44.42 37.58,44.42 33.11,39.95 33.11,38.14 IC6.11
  Bottom 0.406: 60.91,76.83 60.91,73.48 59.79,72.36 59.79,59.65 60.91,58.53 IC9.11 | 60.91,76.83 60.91,78.65 IC11.11 | 74.88,81.72 74.04,82.56 70.69,82.56 69.85,81.72 69.85,77.67 69.01,76.83 60.91,76.83 | 74.88,81.72 79.91,76.69 79.91,76.28 C33.1 | 74.88,81.72 81.86,88.71 85.78,88.71 91.36,83.12 91.36,82.14 95.14,78.37 95.14,75.02 IC12.4 | DVC2.3.5 8.8,77.39 8.8,76.56 1.68,69.43 1.68,56.72 3.77,54.62 PWR.1 | C10.1 17.88,35.62 30.59,35.62 32.97,38 IC6.11 | IC10.11 33.11,78.65 33.11,73.48 34.23,72.36 34.23,59.65 33.11,58.53 IC8.11
CAGE
  Top 0.254: IC1.2 45.68,10.06 44.01,8.38 39.53,8.38 37.86,10.06 36.88,10.06 R2.1 36.74,10.2 35.62,11.32 33.39,11.32 31.01,8.94 29.34,8.94 26.54,6.15 19.84,6.15 18.86,7.12 18.86,15.93 16.07,18.72 16.07,23.33 16.62,23.89 22.91,23.89 24.03,25.01 24.03,25.84 23.33,26.54 22.63,26.54 19.14,30.04 19.14,49.17 16.34,51.97 14.39,51.97 13.41,52.95 13.41,58.81 13.97,59.37 SADI.9
DAC_COS1
  Top 0.254: IC2.6 92.62,20.4 92.34,20.4 89.97,22.77 85.22,22.77 R8.1
DAC_COS2
  Top 0.254: IC3.6 92.62,33.11 92.34,33.11 89.97,35.48 85.22,35.48 R25.1
DAC_COS3
  Top 0.254: IC4.6 92.62,45.82 92.34,45.82 89.97,48.2 85.22,48.2 R43.1
DAC_COS4
  Top 0.254: IC5.6 92.62,58.53 92.34,58.53 89.97,60.91 85.22,60.91 R55.1
DAC_SIN1
  Top 0.254: R7.1 85.22,20.4 87.59,20.4 IC2.8
DAC_SIN2
  Top 0.254: R24.1 85.22,33.11 87.59,33.11 IC3.8
DAC_SIN3
  Top 0.254: R42.1 85.22,45.82 87.59,45.82 IC4.8
DAC_SIN4
  Top 0.254: R54.1 85.22,58.53 87.59,58.53 IC5.8
GND  (via drill 0.3)
  Top 0.508: C19.2 61.05,45.82 63.42,45.82 C20.2 | C14.2 33.11,45.82 35.48,45.82 C15.2 | C17.2 48.34,50.85 48.34,58.4 C27.2 | C9.2 82.56,25.43 85.08,27.94 R22.2 85.08,28.08 85.08,30.45 R23.2 85.36,30.45 87.59,30.45 90.11,32.97 IC3.7 | C12.2 82.56,38.14 85.08,40.65 R40.2 85.08,40.79 85.08,43.17 R41.2 | IC4.7 90.11,45.68 87.73,43.31 85.22,43.31 R41.2 | C24.2 33.11,63.56 35.48,63.56 C25.2 35.62,63.7 43.03,71.11 R62.1 43.31,71.25 45.68,71.25 R63.1 45.96,71.11 48.2,71.11 R64.1 48.48,71.25 50.71,71.25 R65.1 50.99,70.97 57.14,64.82 59.51,64.82 60.77,63.56 C29.2 61.05,63.56 63.42,63.56 C30.2 63.56,63.7 70.97,71.11 R68.1 71.25,71.25 73.62,71.25 R69.1 | C33.2 82.56,76.14 82.56,73.76 C32.2 82.7,73.48 82.7,68.45 84.94,66.22 R57.2 85.08,65.94 85.08,63.56 R56.2 | IC5.7 90.11,58.4 87.73,56.02 85.22,56.02 R53.2 85.08,55.88 85.08,53.51 R52.2 85.08,53.37 82.56,50.85 C22.2 82.56,50.57 82.56,46.52 85.08,44.01 85.08,43.45 R41.2 | DVC2.3.1 3.91,77.53 6.29,77.53 DVC2.3.3 6.57,77.39 9.08,74.88 10.76,74.88 13.27,77.39 13.97,77.39 DVC2.3.9 | 20.4,68.73 20.4,71.11 R58.1 20.54,71.25 22.77,71.25 R59.1 | 20.4,68.73 20.4,63.56 D1.A | SADI.5 8.94,64.82 11.32,64.82 SADI.7 11.46,64.96 11.46,67.2 SADI.8 12.85,68.73 20.4,68.73 | DC/DC.7 5.17,44.42 8.8,44.42 EXT5V.2 | PWR.3 6.43,54.62 6.43,57.14 PWR.4 | IC1.19 66.08,17.88 66.08,21.51 C7.2 | C6.2 83.82,13.97 83.82,10.76 80.05,6.99 80.05,4.05 C5.2 79.91,3.91 73.76,3.91 C4.1 73.2,3.35 61.75,3.35 61.47,3.63 56.02,3.63 C3.1 55.88,4.61 54.62,5.87 54.62,6.84 56.02,8.24 59.09,8.24 60.91,10.06 IC1.8 61.05,10.34 63.84,13.13 v63.84,15.65
  Top 0.508: DC/DC.1 5.17,29.2 5.17,28.78 10.06,23.89 USB.S1 | USB.S1 10.34,23.89 11.73,25.29 15.23,25.29 C1.2 15.23,25.57 15.23,32.83 C11.2 15.23,33.11 15.23,35.48 C10.2 15.23,35.76 15.23,45.68 T2.E | USB.S2 10.2,11.87 12.85,14.53 12.85,16.48 USB.4 12.85,16.76 10.34,19.28 10.34,23.61 USB.S1 | C2.2 29.2,10.2 25.29,10.2 22.91,12.57 DOA.6
  Bottom 0.508: 46.1,48.62 48.2,50.71 C17.2 | 46.1,48.62 44.42,46.94 37.58,46.94 36.46,45.82 35.62,45.82 C15.2 | 46.1,48.62 50.29,44.42 58.95,44.42 60.21,45.68 60.91,45.68 C19.2 | R23.2 85.08,30.59 85.08,31.29 82.56,33.81 82.56,38 C12.2 | R90.1 82.56,87.59 82.56,81.31 83.82,80.05 C34.2 83.82,79.77 82.56,78.51 82.56,76.28 C33.2 | R56.2 85.22,63.42 90.11,58.53 IC5.7 | R69.1 73.76,71.25 80.05,71.25 82.42,73.62 C32.2 | C27.2 48.2,58.53 48.2,59.23 46.94,60.49 46.94,69.99 45.82,71.11 R63.1 | 10.06,45.82 15.23,45.82 T2.E 15.37,45.54 16.48,44.42 31.01,44.42 32.27,45.68 32.97,45.68 C14.2 | 10.06,45.82 EXT5V.1 8.8,47.22 6.43,49.59 6.43,54.48 PWR.3 | EXT5V.2 8.94,44.56 10.06,45.68 10.06,45.82 | SADI.5 8.8,64.68 8.8,59.65 6.43,57.28 PWR.4 | DVC2.3.9 13.97,69.85 SADI.8 | C8.- 73.62,21.65 66.08,21.65 C7.2 | IC2.7 C6.2 | v63.84,15.65 65.94,17.74 IC1.19 | RST.1 29.2,21.51 28.92,21.51 22.77,15.37 DOA.4 | DOA.4 22.63,15.37 20.4,15.37 DOA.3 20.12,15.09 18.72,13.69 | 18.72,13.69 18.72,6.99 21.79,3.91 29.06,3.91 USB/DOA.1 29.34,3.91 34.23,3.91 R5.1 34.51,3.77 35.76,2.52 44.01,2.52 45.26,3.77 55.88,3.77 C3.1 | DOA.6 22.91,12.71 22.91,15.09 DOA.4 | USB.4 12.99,16.48 15.65,13.83 18.58,13.83 18.72,13.69
N$1  (via drill 0.3)
  Top 0.254: R7.2 77.39,20.26 73.9,20.26 72.22,18.58 72.22,16.62 71.53,15.93 70.69,15.93 69.99,16.62 69.99,23.05 77.39,30.45 R23.1 | v69.85,26.26 34.09,26.26 30.59,29.76 30.59,30.45 IC6.3
  Bottom 0.254: v69.85,26.26 70.97,26.26 71.53,26.82 73.76,26.82 77.39,30.45 R23.1
N$2
  Top 0.254: R11.2 22.91,27.94 25.43,30.45 IC6.1 24.31,31.57 24.31,38.28 23.33,39.26 22.63,39.26 21.65,40.23 21.65,53.78 22.77,54.9 22.77,55.88 R44.1
N$3
  Bottom 0.254: 77.53,25.43 77.53,27.94 R22.1 | 77.53,25.43 77.53,22.91 R8.2 | 77.53,25.43 73.2,25.43 72.92,25.15 41.21,25.15 35.9,30.45 35.62,30.45 IC6.5
N$4
  Top 0.254: C13.1 25.43,45.82 25.43,48.2 R33.1 25.29,48.34 22.91,50.71 22.91,53.23 R32.2
N$5
  Top 0.254: IC8.3 30.59,50.71 32.97,48.34 R33.2
  Bottom 0.254: C14.1 30.59,45.82 32.97,48.2 R33.2
N$6
  Top 0.254: 27.94,50.85 25.43,50.85 IC8.1 | 27.94,50.85 29.06,51.97 29.06,72.22 24.31,76.97 24.31,78.93 22.91,80.33 22.91,81.17 R72.1 | 27.94,50.85 IC8.2 C13.2
N$7
  Bottom 0.254: IC1.12 71.25,10.2 73.06,12.01 84.1,12.01 85.22,10.9 88.43,10.9 90.11,12.57 IC2.2
N$8
  Top 0.254: IC1.11 68.59,10.2 68.87,10.2 73.48,14.81 82.98,14.81 86.61,18.44 93.32,18.44 95.14,20.26 IC2.5
N$9
  Top 0.254: R44.2 22.91,63.56 25.29,63.56 C23.1 25.43,63.42 25.43,61.05 R45.1
N$10
  Top 0.254: IC8.14 25.43,58.4 27.94,58.4 IC8.13 27.94,63.42 | 27.94,63.42 22.91,68.45 R60.1 | 27.94,63.42 C23.2
N$11
  Top 0.254: R13.1 35.62,27.94 38.14,30.45 IC6.6 38.14,30.32 39.81,28.64 41.07,28.64 41.49,29.06 43.31,29.06 44.7,30.45 45.68,30.45 R15.2
N$12
  Top 0.254: R47.1 45.68,55.88 45.68,54.9 41.77,50.99 41.77,41.49 39.53,39.26 39.53,31.57 40.51,30.59 IC6.7
  Bottom 0.254: R13.2 43.17,27.94 40.65,30.45 IC6.7
N$13  (via drill 0.3)
  Top 0.254: R24.2 77.53,33.11 79.21,34.78 79.21,41.49 77.53,43.17 R41.1 | v62.03,35.76 67.75,35.76 v69.15,34.37
  Bottom 0.254: v62.03,35.76 38.14,35.76 35.9,38 35.62,38 IC6.10 | v69.15,34.37 76.14,34.37 77.39,33.11 R24.2
N$14
  Bottom 0.254: IC1.24 53.37,17.88 53.65,17.88 56.02,20.26 75.86,20.26 77.25,21.65 82.28,21.65 84.66,24.03 86.75,24.03 87.17,23.61 88.43,23.61 90.11,25.29 IC3.2
N$15
  Top 0.254: IC1.25 50.85,17.88 51.13,17.88 58.67,25.43 70.13,25.43 71.53,26.82 72.22,26.82 77.25,31.85 79.77,31.85 84.66,36.74 86.75,36.74 87.17,36.32 88.43,36.32 90.11,38 IC4.2
N$16
  Top 0.254: IC8.12 R45.2 32.97,61.05 30.59,63.42 C24.1
N$17
  Top 0.254: R48.2 50.85,63.56 53.23,63.56 C28.1 53.37,63.42 53.37,61.05 R49.1
N$18
  Top 0.254: T1.E 15.23,58.53 15.23,65.94 16.48,67.2 SADI.12
N$19
  Top 0.254: IC6.9 38,38.14 35.62,40.51 R28.1
  Bottom 0.254: R14.2 43.17,38 42.75,38 41.07,36.32 39.81,36.32 38.14,38 IC6.9
N$20
  Top 0.254: IC5.5 97.51,56.16 97.51,11.87 95.97,10.34 93.18,10.34 85.36,2.52 54.34,2.52 50.85,6.01 50.85,10.06 IC1.4
N$21  (via drill 0.3)
  Top 0.254: v64.96,24.31 70.13,24.31 v71.81,25.98
  Bottom 0.254: v64.96,24.31 52.53,24.31 47.08,18.86 47.08,16.62 53.23,10.48 53.23,10.2 IC1.5 | v71.81,25.98 73.9,25.98 77.25,29.34 85.5,29.34 86.47,30.32 86.47,47.08 90.11,50.71 IC5.2
N$22
  Top 0.254: IC9.12 R49.2 60.91,61.05 58.53,63.42 C29.1
N$23
  Top 0.254: IC6.8 40.65,38.14 43.17,40.65 R28.2 43.31,40.65 45.68,43.03 45.68,45.68 R35.1
N$24
  Top 0.254: IC1.17 71.25,17.88 71.25,23.47 73.2,25.43 80.89,25.43 82,24.31 83.12,24.31 83.96,25.15 83.96,25.84 84.94,26.82 86.75,26.82 91.08,31.15 93.32,31.15 95.14,32.97 IC3.5
N$25
  Top 0.254: IC2.4 95.28,12.71 95.28,18.02 96.39,19.14 96.39,24.17 95.28,25.29 IC3.4 93.46,23.61 87.17,23.61 86.75,24.03 84.66,24.03 76,15.37 70.41,15.37 68.59,17.18 68.59,17.74 IC1.18
  Bottom 0.254: IC5.4 95.14,50.71 94.16,49.73 94.16,44.56 95.14,43.59 95.14,38.14 IC4.4 95.14,38 95.14,35.2 94.16,34.23 94.16,26.4 95.14,25.43 IC3.4
N$26
  Top 0.254: R40.1 77.53,40.51 77.53,35.62 R25.2 77.39,35.48 77.11,35.48 72.5,30.87 72.5,30.32 71.53,29.34 70.97,29.34 68.45,26.82 34.37,26.82 31.85,29.34 31.85,31.43 30.59,32.69 30.59,38 IC6.12
N$27
  Top 0.254: C18.1 53.37,45.82 53.37,48.2 R37.1 53.23,48.34 50.85,50.71 50.85,53.23 R36.2
N$28
  Top 0.254: C19.1 58.53,45.82 60.91,48.2 R37.2 60.91,48.34 58.53,50.71 IC9.3
N$29
  Top 0.254: IC9.1 53.37,50.85 55.88,50.85 IC9.2 C18.2
  Bottom 0.254: R78.1 50.71,81.17 50.71,80.33 49.59,79.21 49.59,58.67 53.23,55.04 53.23,50.85 IC9.1
N$30
  Top 0.254: R27.1 30.45,40.51 27.94,38 IC6.13
  Bottom 0.254: R9.2 20.4,38 21.37,38 23.05,36.32 26.26,36.32 27.94,38 IC6.13
N$31
  Top 0.254: IC6.14 25.29,38.14 22.91,40.51 R27.2 22.91,40.65 22.91,45.68 R32.1
N$32
  Top 0.254: R52.1 77.53,53.23 77.53,48.34 R43.2
  Bottom 0.254: IC7.12 58.53,38.14 64.96,44.56 74.18,44.56 77.39,47.78 77.39,48.2 R43.2
N$33
  Top 0.254: IC9.14 53.37,58.4 55.88,58.4 IC9.13 55.88,63.42 | 55.88,63.42 50.85,68.45 R66.1 | 55.88,63.42 C28.2
N$34
  Bottom 0.254: IC1.26 48.34,17.74 51.83,14.25 77.39,14.25 84.8,21.65 86.75,21.65 88.15,23.05 95.14,23.05 96.39,24.31 96.39,44.56 95.28,45.68 IC4.5
N$35
  Top 0.254: R90.2 80.05,90.11 80.05,86.33 83.82,82.56 C34.1 83.82,82.42 84.24,82.42 91.64,75.02 92.62,75.02 IC12.3
N$36
  Top 0.254: R90.3 82.56,92.76 86.33,92.76 R91.2
N$37
  Top 0.254: D1.C 17.04,55.88 | 17.04,55.88 T1.C | 17.04,55.88 17.04,58.95 16.62,59.37 16.62,64.68 SADI.11
N$38
  Top 0.254: IC1.27 45.68,17.88 45.4,17.88 38,25.29 30.59,25.29 R12.2
N$39
  Top 0.254: R11.1 30.45,27.94 27.94,30.45 IC6.2
  Bottom 0.254: R10.2 22.91,30.59 23.19,30.59 24.87,32.27 26.26,32.27 27.94,30.59 IC6.2
N$40
  Top 0.254: R19.1 63.56,27.94 66.08,30.45 IC7.6
  Bottom 0.254: R20.2 71.11,30.59 70.69,30.59 69.01,32.27 67.75,32.27 66.08,30.59 IC7.6
N$41
  Top 0.254: R53.1 77.39,55.88 77.39,54.9 76.28,53.78 76.28,46.94 77.39,45.82 R42.2
  Bottom 0.254: IC7.3 58.53,30.59 58.81,30.59 63.98,35.76 72.92,35.76 76.28,39.12 76.28,44.56 77.39,45.68 R42.2
N$42
  Top 0.254: R18.1 58.4,27.94 55.88,30.45 IC7.2
  Bottom 0.254: R16.2 48.34,30.59 49.31,30.59 50.99,32.27 54.2,32.27 55.88,30.59 IC7.2
N$43  (via drill 0.3)
  Top 0.254: 95.76,27.17 95.69,27.24 94.58,27.24 92.76,25.43 IC3.3 | 95.76,27.17 96.95,25.98 96.95,12.15 95.69,10.9 94.72,10.9 93.04,12.57 92.76,12.57 IC2.3 | v62.87,13.41 58.53,17.74 IC1.22 | 95.76,27.17 96.39,27.8 96.39,34.09 92.76,37.72 92.76,38 IC4.3 92.76,38.14 93.88,39.26 93.88,46.8 92.76,47.92 92.76,50.71 IC5.3
  Bottom 0.254: v62.87,13.41 68.03,13.41 68.31,13.69 84.52,13.69 84.94,14.11 86.75,14.11 87.17,14.53 90.81,14.53 92.62,12.71 IC2.3
N$44
  Top 0.254: R18.2 50.85,27.94 53.37,30.45 IC7.1 49.59,34.23 49.59,53.78 50.71,54.9 50.71,55.88 R48.1
N$45
  Top 0.254: 55.88,38 54.2,36.32 52.81,36.32 51.13,38 50.85,38 R17.2 | 55.88,38 58.4,40.51 R29.1 | 55.88,38 IC7.13
N$46
  Top 0.254: IC7.14 53.23,38.14 50.85,40.51 R29.2 50.85,40.65 50.85,45.68 R36.1
N$47
  Top 0.254: R57.1 77.53,65.94 77.53,65.1 78.65,63.98 78.65,59.65 77.53,58.53 R54.2
  Bottom 0.254: IC7.5 63.56,30.59 63.84,30.59 68.45,35.2 73.62,35.2 78.65,40.23 78.65,57.28 77.53,58.4 R54.2
N$48
  Top 0.254: R51.1 73.76,55.88 73.76,54.9 74.88,53.78 74.88,42.75 71.39,39.26 70.69,39.26 69.99,38.56 69.99,31.99 68.59,30.59 IC7.7
  Bottom 0.254: R19.2 71.11,27.94 68.59,30.45 IC7.7
N$49
  Top 0.254: IC7.10 63.42,38.14 63.42,39.12 62.31,40.23 62.31,41.07 65.8,44.56 69.01,44.56 69.99,45.54 69.99,53.78 77.11,60.91 77.39,60.91 R55.2 77.53,61.05 77.53,63.42 R56.1
N$50
  Top 0.254: IC7.9 65.94,38.14 63.56,40.51 R30.1
  Bottom 0.254: R21.2 73.62,38 72.64,38 70.97,36.32 67.75,36.32 66.08,38 IC7.9
N$51
  Top 0.254: IC1.14 76.28,10.06 78.79,10.06 79.91,8.94 C5.1
N$52
  Top 0.254: IC7.8 68.59,38.14 71.11,40.65 R30.2 71.25,40.65 73.62,43.03 73.62,45.68 R39.1
N$53
  Top 0.254: IC8.5 35.62,50.71 35.62,48.34 R34.2 C15.1
N$54  (via drill 0.3)
  Top 0.254: v51.41,15.93 42.75,15.93 40.51,18.16 40.51,21.23 38.7,23.05 v16.9,23.05
  Bottom 0.254: v51.41,15.93 56.3,15.93 57,16.62 57,18.58 57.98,19.56 71.67,19.56 73.34,17.88 73.62,17.88 IC1.16 | v16.9,23.05 12.99,19.14 USB.3
N$55
  Top 0.254: C16.1 43.17,45.82 43.17,48.2 R34.1 43.31,48.34 45.68,50.71 45.68,53.23 R35.2
N$56
  Top 0.254: IC8.6 38.14,50.85 40.51,50.85 IC8.7 40.65,50.71 40.65,45.82 C16.2
  Bottom 0.254: R74.1 43.31,81.17 43.31,80.19 44.28,79.21 44.28,54.48 40.65,50.85 IC8.7
N$57
  Top 0.254: IC8.10 35.62,58.53 35.62,60.91 R46.2 35.62,61.05 38,63.42 C25.1
N$58
  Top 0.254: IC8.9 38.14,58.4 40.51,58.4 IC8.8 40.65,58.53 40.65,63.42 C26.2 40.65,63.56 43.17,66.08 43.17,68.45 R61.1
N$59
  Top 0.254: R46.1 43.17,61.05 43.17,63.42 C26.1 43.31,63.56 45.68,63.56 R47.2
N$60
  Top 0.254: IC9.10 63.56,58.53 63.56,60.91 R50.2 63.56,61.05 65.94,63.42 C30.1
N$61  (via drill 0.3)
  Top 0.254: v55.18,15.09 54.9,15.09 51.83,12.01 50.43,12.01 49.45,11.04 49.45,9.08 43.03,2.65 39.53,2.65 34.65,7.54 32.97,7.54 30.45,5.03 20.12,5.03 16.07,9.08 16.07,17.88 14.95,19 USB.2
  Bottom 0.254: v55.18,15.09 55.46,14.81 72.92,14.81 75.86,17.74 76.14,17.74 IC1.15
N$62
  Top 0.254: R4.1 30.45,2.52 21.79,2.52 14.95,9.36 14.95,16.48 USB.1
N$63
  Top 0.254: R4.2 R5.2
  Bottom 0.254: IC1.13 73.62,10.06 73.34,10.06 69.99,6.71 57.84,6.71 56.16,5.03 45.54,5.03 44.42,3.91 41.91,3.91 R5.2
N$64
  Top 0.254: RST.2 29.2,19.14 23.47,19.14 23.33,19.28 21.79,19.28 20.4,17.88 DOA.1
N$65
  Top 0.254: 67.2,6.43 67.2,8.94 66.08,10.06 IC1.10 | 67.2,6.43 67.2,5.17 Q1.1 | 67.2,6.43 73.62,6.43 C4.2
N$66
  Top 0.254: 62.31,6.43 62.31,8.94 63.42,10.06 IC1.9 | 62.31,6.43 62.31,5.17 Q1.2 | 62.31,6.43 55.88,6.43 C3.2
N$67
  Top 0.254: R3.1 39.4,10.2 43.17,10.2 IC1.1 | C2.1 29.2,12.71 29.2,16.48 RST.3
  Bottom 0.254: R3.1 39.26,10.2 38.42,10.2 36.04,12.57 29.34,12.57 C2.1
N$68
  Top 0.254: R50.1 71.11,61.05 71.11,63.42 C31.1 71.25,63.56 73.62,63.56 R51.2
N$69
  Top 0.254: IC9.9 66.08,58.4 68.45,58.4 IC9.8 68.59,58.53 68.59,63.42 C31.2 68.59,63.56 71.11,66.08 71.11,68.45 R67.1
N$70
  Top 0.254: IC9.5 63.56,50.71 63.56,48.34 R38.2 C20.1
N$71
  Top 0.508: DOA.9 20.4,7.68 20.4,10.06 DOA.7 | DOA.8 22.77,10.2 20.54,10.2 DOA.7 | DOA.5 20.4,12.57 20.4,10.34 DOA.7
N$72
  Top 0.254: IC1.23 55.88,16.9 53.23,14.25 33.95,14.25 30.45,17.74 22.91,17.74 DOA.2
N$73
  Bottom 0.254: R6.1 44.42,6.43 44.42,11.18 38.14,17.46 38.14,21.51 DIAG.K
N$74
  Top 0.254: R6.2 52.11,6.43 55.88,10.2 IC1.6
N$75
  Bottom 0.254: IC1.7 58.4,10.06 58.12,10.06 55.6,7.54 47.22,7.54 44.7,5.03 25.43,5.03 22.91,7.54 DOA.10
N$76
  Top 0.254: USB/DOA.2 29.34,6.43 32.97,10.06 34.23,10.06 R1.1 34.37,10.06 36.6,7.82 45.68,7.82 47.92,10.06 48.2,10.06 IC1.3
N$77
  Top 0.254: IC9.6 66.08,50.85 68.45,50.85 IC9.7 68.59,50.71 68.59,45.82 C21.2
  Bottom 0.254: R80.1 71.25,81.17 71.25,80.19 72.22,79.21 72.22,54.48 68.59,50.85 IC9.7
N$78
  Top 0.254: C21.1 71.11,45.82 71.11,48.2 R38.1 71.25,48.34 73.62,50.71 73.62,53.23 R39.2
N$79
  Top 0.254: R82.3 27.94,92.76 25.43,90.25 R82.2 25.29,90.11 19.98,90.11 19.14,89.27 19.14,72.22 | 19.14,72.22 8.8,72.22 3.91,67.33 SADI.2 | 19.14,72.22 23.33,72.22 24.31,71.25 25.29,71.25 IC10.1
N$80
  Top 0.254: R88.3 65.94,92.62 63.56,90.25 R88.2 63.42,90.11 62.45,89.13 52.95,89.13 48.34,93.74 22.63,93.74 8.94,80.05 DVC2.3.6
  Bottom 0.254: IC11.8 68.45,78.79 68.45,83.68 63.56,88.57 63.56,90.11 R88.2
N$81
  Top 0.254: R85.2 40.65,90.25 43.17,92.76 R85.3
  Bottom 0.254: IC10.7 40.65,71.25 40.65,76.42 41.77,77.53 41.77,88.99 40.65,90.11 R85.2 | SADI.6 8.94,67.33 8.94,73.34 10.2,74.6 10.2,80.47 23.47,93.74 42.19,93.74 43.17,92.76 R85.3
N$82
  Top 0.254: R26.1 20.4,41.91 20.4,45.68 R31.1
  Bottom 0.254: T2.C 15.37,50.71 20.26,45.82 R31.1
N$83
  Top 0.254: R84.2 35.62,90.25 38,92.62 R84.3
  Bottom 0.254: 36.25,87.94 35.62,88.57 35.62,90.11 R84.2 | 36.25,87.94 40.51,83.68 40.51,78.79 IC10.8 | 36.25,87.94 31.01,82.7 30.32,82.7 29.34,81.72 29.34,77.81 28.5,76.97 27.1,76.97 21.65,71.53 21.65,70.69 17.04,66.08 8.38,66.08 7.26,67.2 6.43,67.2 SADI.4
N$84
  Top 0.254: 48.34,78.79 48.34,81.17 R76.1 | 48.34,78.79 55.88,71.25 IC11.2 | 48.34,78.79 R64.2
N$85
  Top 0.254: R83.3 32.97,92.62 30.59,90.25 R83.2 30.45,90.11 30.45,88.71 25.43,83.68 25.43,78.79 IC10.14
  Bottom 0.254: SADI.10 13.97,67.33 25.29,78.65 IC10.14
N$86
  Top 0.254: 51.9,80.82 51.97,80.89 51.97,82.7 50.85,83.82 R77.1 | 51.9,80.82 50.85,79.77 50.85,78.79 R65.2 | IC11.13 55.88,78.79 55.6,78.79 53.65,80.75 51.97,80.75 51.9,80.82
N$87
  Top 0.254: R60.2 30.45,68.59 30.45,71.11 IC10.3
N$88
  Top 0.254: R61.2 35.62,68.59 35.62,71.11 IC10.5
N$89
  Top 0.254: IC10.10 35.62,78.79 35.62,81.17 R74.2
N$90
  Top 0.254: IC10.12 30.45,78.79 30.45,81.17 R72.2
N$91
  Bottom 0.254: 23.96,80.82 24.03,80.89 24.03,82.7 22.91,83.82 R71.1 | 23.96,80.82 22.91,79.77 22.91,78.79 R59.2 | IC10.13 27.94,78.79 27.66,78.79 25.7,80.75 24.03,80.75 23.96,80.82
N$92
  Top 0.254: 20.4,78.79 27.94,71.25 IC10.2 | 20.4,78.79 20.4,81.17 R70.1 | 20.4,78.79 R58.2
N$93
  Top 0.254: 45.68,78.79 38.14,71.25 IC10.6 | 45.68,78.79 45.68,81.17 R75.1 | 45.68,78.79 R63.2
N$94
  Top 0.254: IC10.9 38.14,78.65 38.42,78.65 40.09,76.97 41.49,76.97 43.17,78.65 R62.2 43.31,78.79 44.28,79.77 44.28,81.72 43.31,82.7 43.31,83.82 R73.1
N$95
  Top 0.254: R83.1 32.97,87.59 32.97,86.19 30.59,83.82 R71.2
N$96
  Top 0.254: R82.1 27.94,87.73 21.51,87.73 20.4,88.85 R70.2
N$97
  Top 0.254: R85.1 43.31,87.73 44.56,87.73 45.68,88.85 R75.2
N$98
  Top 0.254: R84.1 38,87.59 38,86.19 35.62,83.82 R73.2
N$99
  Top 0.254: R86.3 55.88,92.76 53.37,90.25 R86.2 53.23,90.25 49.17,94.3 21.37,94.3 7.12,80.05 6.43,80.05 DVC2.3.4
  Bottom 0.254: IC11.1 53.23,71.25 53.23,76.56 52.25,77.53 52.25,89.13 53.23,90.11 R86.2
N$100
  Top 0.254: 73.62,78.79 66.08,71.25 IC11.6 | 73.62,78.79 73.62,81.17 R81.1 | 73.62,78.79 R69.2
N$101
  Top 0.254: R87.2 58.53,90.25 60.91,92.62 R87.3
  Bottom 0.254: IC11.14 53.37,78.79 53.37,83.68 58.4,88.71 58.4,90.11 R87.2 | R87.3 59.37,94.3 18.86,94.3 4.61,80.05 3.91,80.05 DVC2.3.2
N$102
  Top 0.254: IC11.9 66.08,78.65 66.36,78.65 68.03,76.97 69.43,76.97 71.11,78.65 R68.2 71.25,78.79 72.22,79.77 72.22,81.72 71.25,82.7 71.25,83.82 R79.1
N$103
  Top 0.254: R89.3 71.11,92.76 68.59,90.25 R89.2 68.59,90.11 68.59,88.71 74.88,82.42 74.88,78.37 68.59,72.08 68.59,71.25 IC11.7
  Bottom 0.254: DVC2.3.8 11.46,80.05 12.29,80.05 18.86,86.61 30.59,86.61 35.2,91.22 67.47,91.22 68.45,90.25 R89.2
N$104
  Top 0.254: R89.1 71.25,87.73 72.5,87.73 73.62,88.85 R81.2
N$105
  Top 0.254: R86.1 55.88,87.73 49.45,87.73 48.34,88.85 R76.2
N$106
  Top 0.254: IC11.12 58.4,78.79 58.4,81.17 R78.2
N$107
  Top 0.254: R66.2 58.4,68.59 58.4,71.11 IC11.3
N$108
  Top 0.254: R87.1 60.91,87.59 60.91,86.19 58.53,83.82 R77.2
N$109
  Top 0.254: R88.1 65.94,87.59 65.94,86.19 63.56,83.82 R79.2
N$110
  Top 0.254: IC11.10 63.56,78.79 63.56,81.17 R80.2
N$111
  Top 0.254: R67.2 63.56,68.59 63.56,71.11 IC11.5
N$112
  Top 0.254: T1.B 15.37,53.37 20.26,53.37 R31.2
OFF_FLG
  Top 0.254: T2.B 15.37,48.2 15.37,47.92 17.04,46.24 17.04,36.46 16.62,36.04 16.62,31.57 22.77,25.43 R12.1
OUT  (via drill 0.3)
  Top 0.254: v11.04,44.84 10.2,45.68 7.68,45.68 6.84,46.52 6.84,49.87 1.82,54.9 1.82,67.06 8.94,74.18 12.43,74.18 15.23,76.97 15.23,78.65 13.97,79.91 DVC2.3.10
  Bottom 0.254: v11.04,44.84 11.04,38.14 14.81,34.37 15.51,34.37 16.34,33.53 16.34,32.83 22.35,26.82 34.92,26.82 43.17,18.58 43.17,17.88 IC1.28
SHIFT
  Top 0.254: R9.1 20.4,30.59 20.4,35.62 22.77,38 R10.1 | 43.31,31.57 43.31,35.62 45.68,38 R15.1 45.82,38.14 48.2,38.14 R16.1 | 43.31,31.57 43.31,30.59 R14.1 | 43.31,31.57 48.76,31.57 49.73,30.59 50.71,30.59 R17.1 | 90.11,73.76 90.11,74.88 IC12.2 | 90.11,73.76 90.11,72.5 TP1.TP 90.11,72.36 90.11,66.92 85.36,62.17 84.66,62.17 78.65,56.16 78.65,45.26 77.67,44.28 76.97,44.28 76.28,43.59 76.28,41.77 | 90.11,73.76 93.18,73.76 93.88,74.46 93.88,75.44 92.76,76.56 92.76,82.42 IC12.6 | 76.28,41.77 74.88,41.77 71.25,38.14 R20.1 | 76.28,41.77 77.95,41.77 78.65,41.07 78.65,35.06 77.95,34.37 77.25,34.37 73.76,30.87 73.76,30.59 R21.1
  Bottom 0.254: R15.1 44.56,39.26 42.89,39.26 40.37,41.77 26.82,41.77 23.19,38.14 22.91,38.14 R10.1 | R16.1 48.34,38 49.31,38 50.99,36.32 61.47,36.32 61.75,36.6 62.73,36.6 63.01,36.32 63.98,36.32 64.82,37.16 64.82,39.12 65.66,39.95 69.29,39.95 71.11,38.14 R20.1

### Text on the board
Top: henkie
Bottom: henkie
tNames: ZERO | TMR1211 | QUAD SIN/COS / INTERFACE | + | V1.0